# EasyEDA Pro project ProPrj_Arduino_Contest_2025_2025-11-19.epro, schematic Sensor_Module_Rev_1

## Sheets
1 Terminals: Board Name: Sensor_Module_Rev_1; Create Date: 2025-09-15; Page Name: Terminals; Project Name: Arduino_Prj_boards; Schematic Name: Sensor_Module_Rev_1; Update Date: 2025-09-15; Revision: REV0
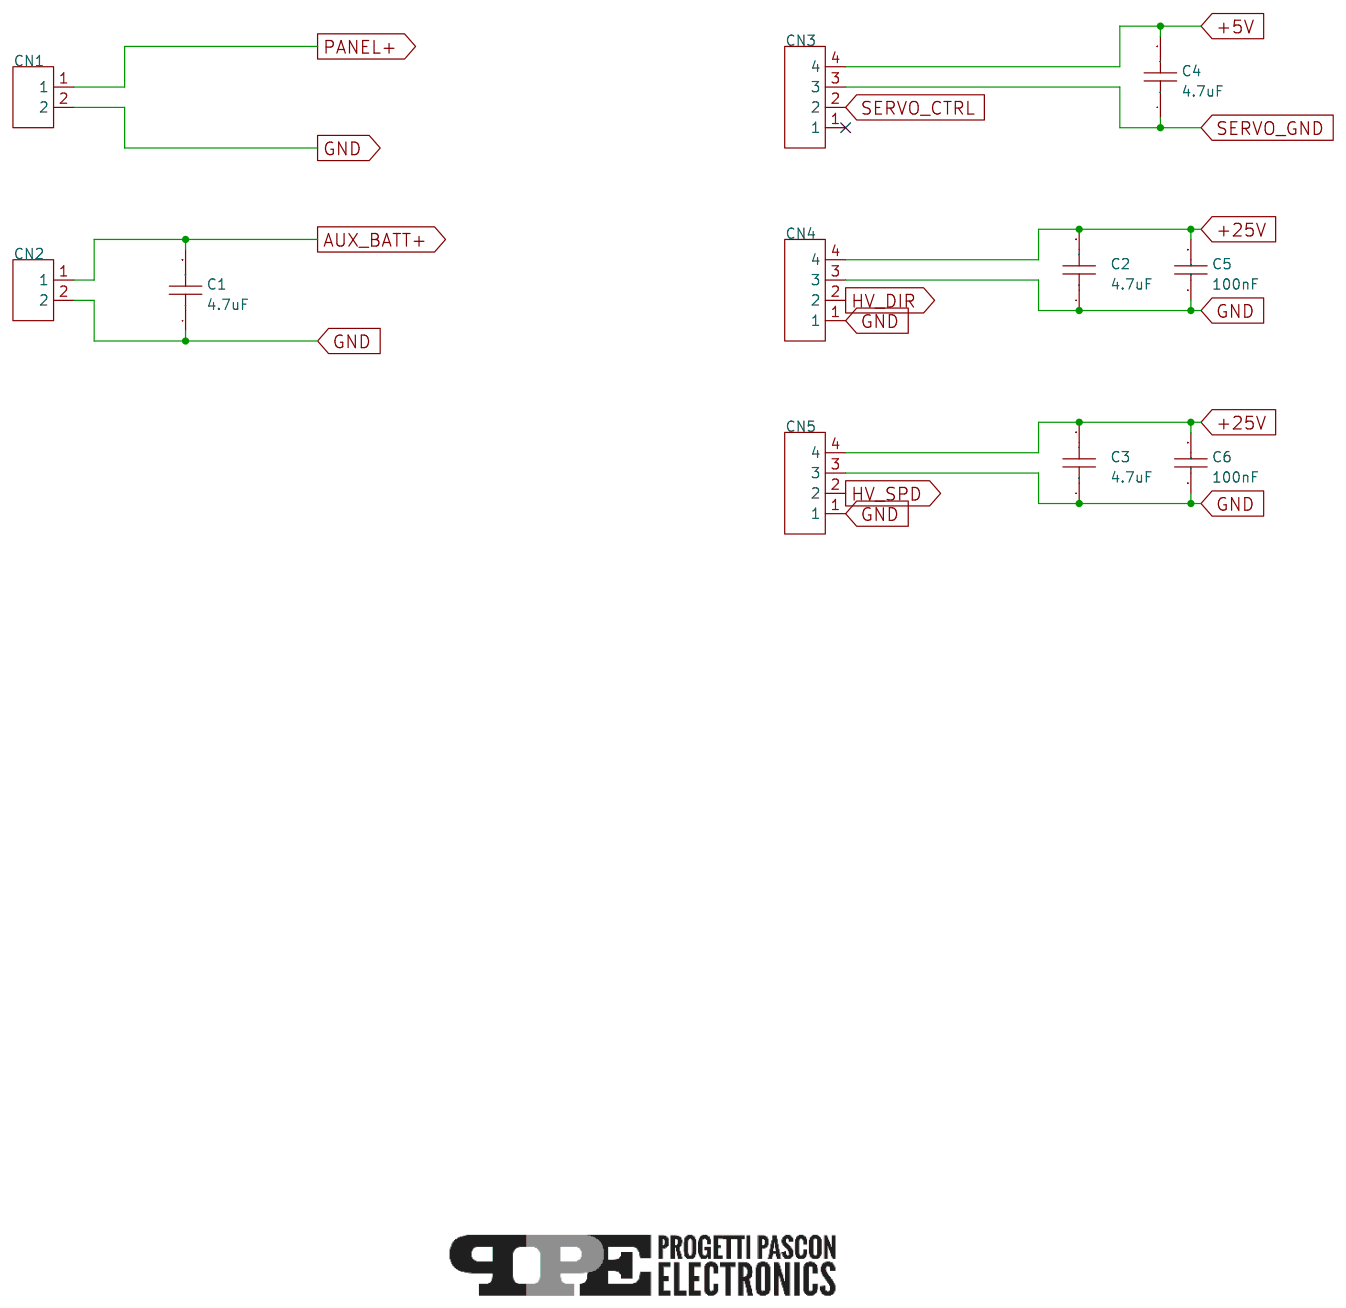
[diagram p7: Terminals]
2 Panel Management: Page Name: Panel Management; Update Date: 2025-09-17
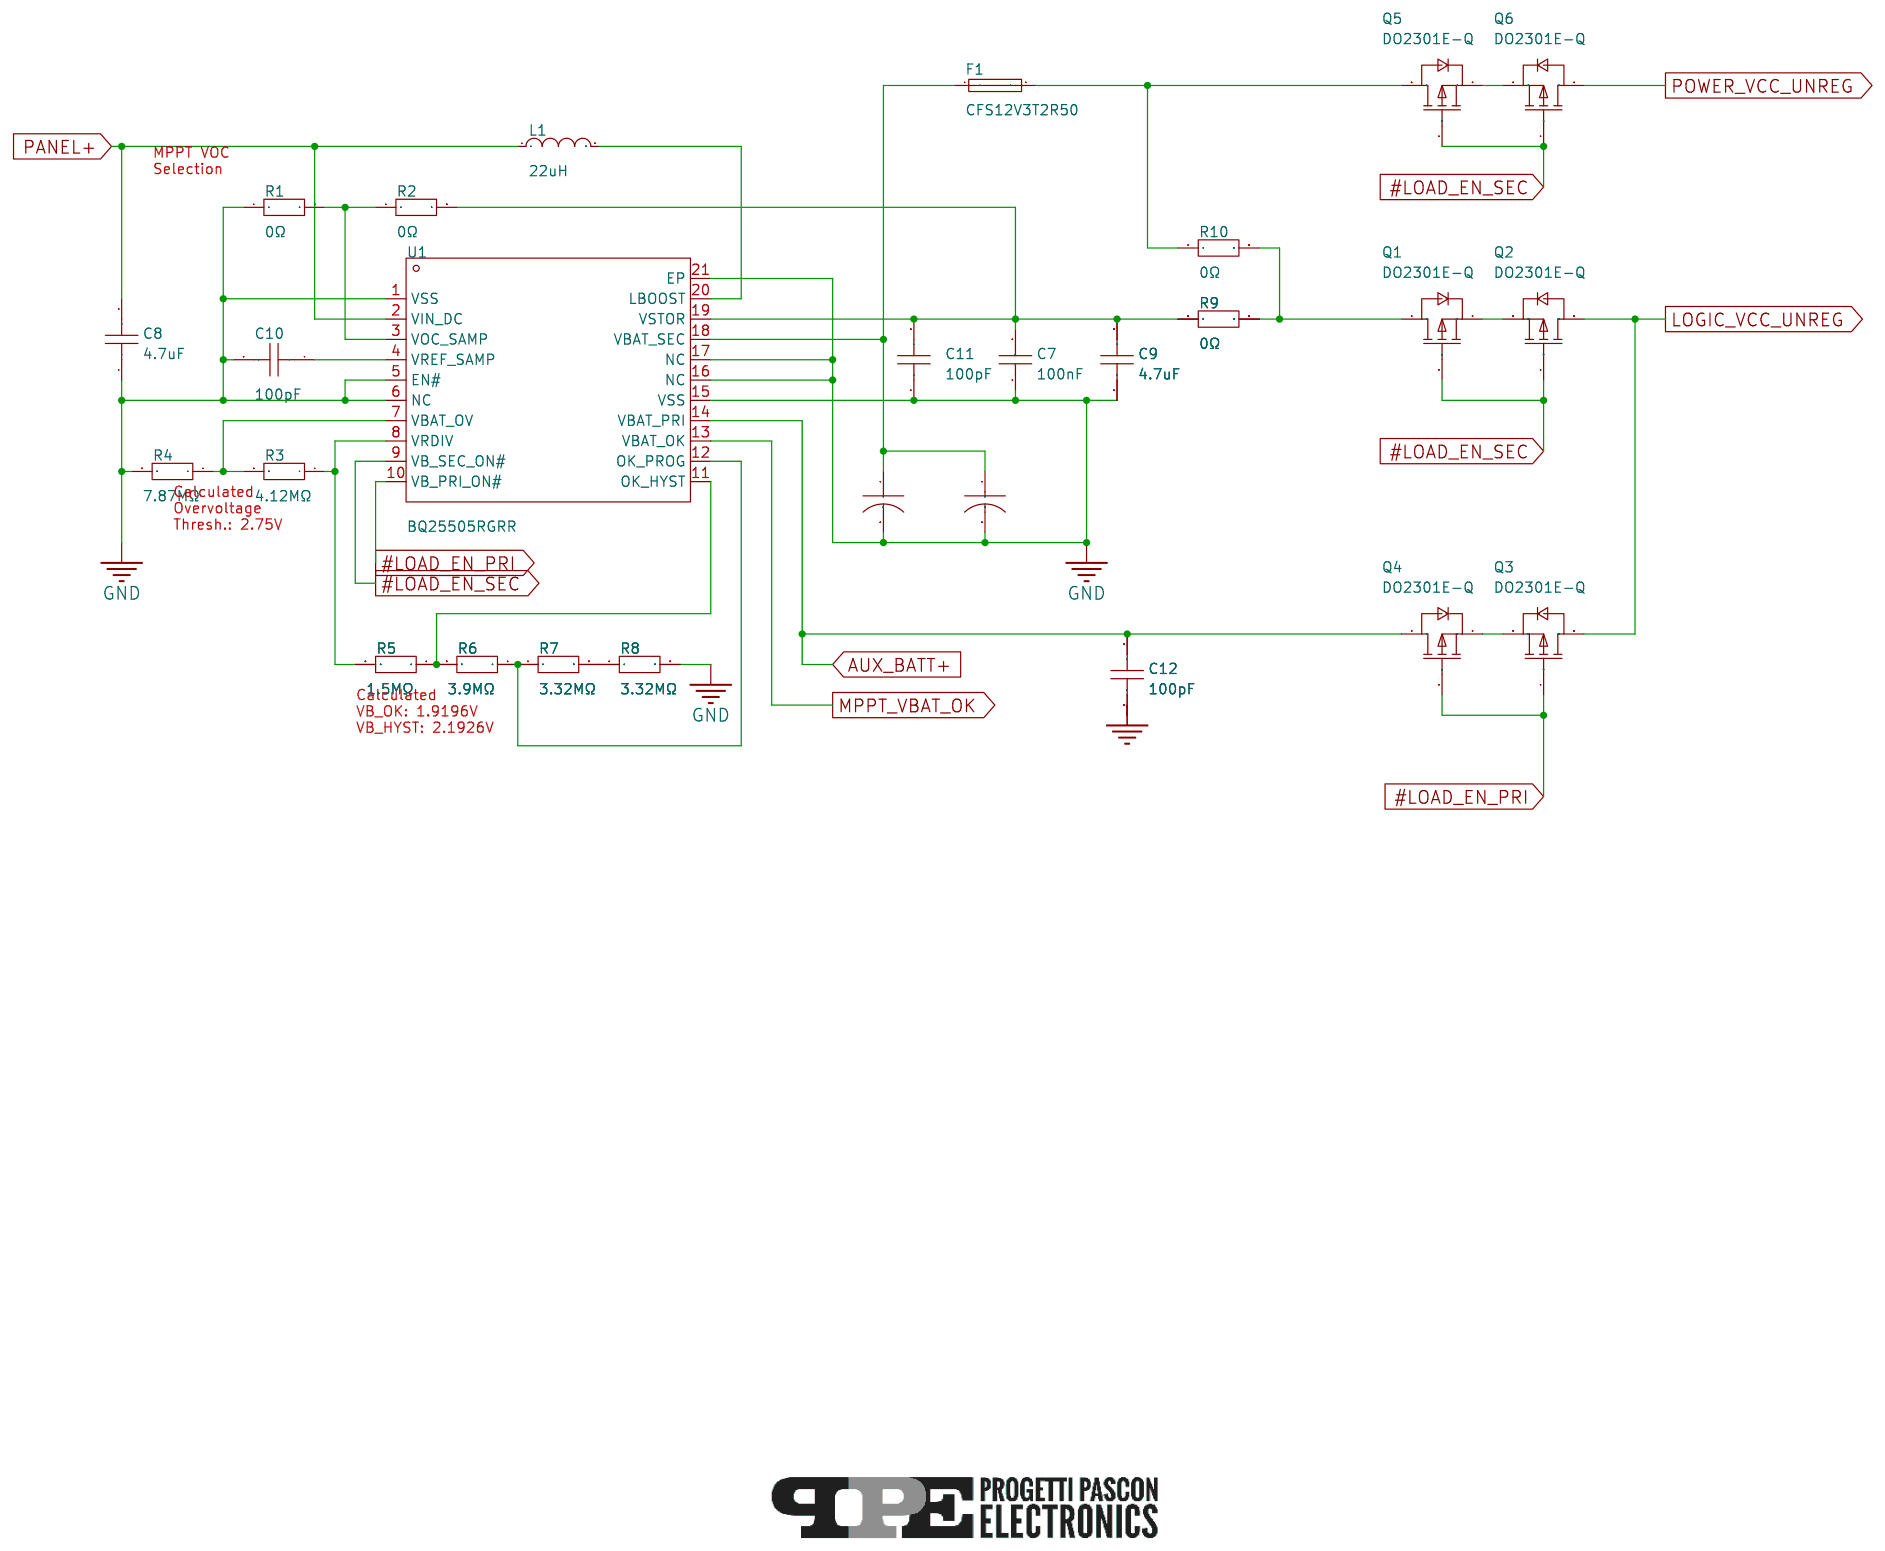
[diagram p8: Panel Management]
3 Geiger Counter: Page Name: Geiger Counter; Update Date: 2025-09-17
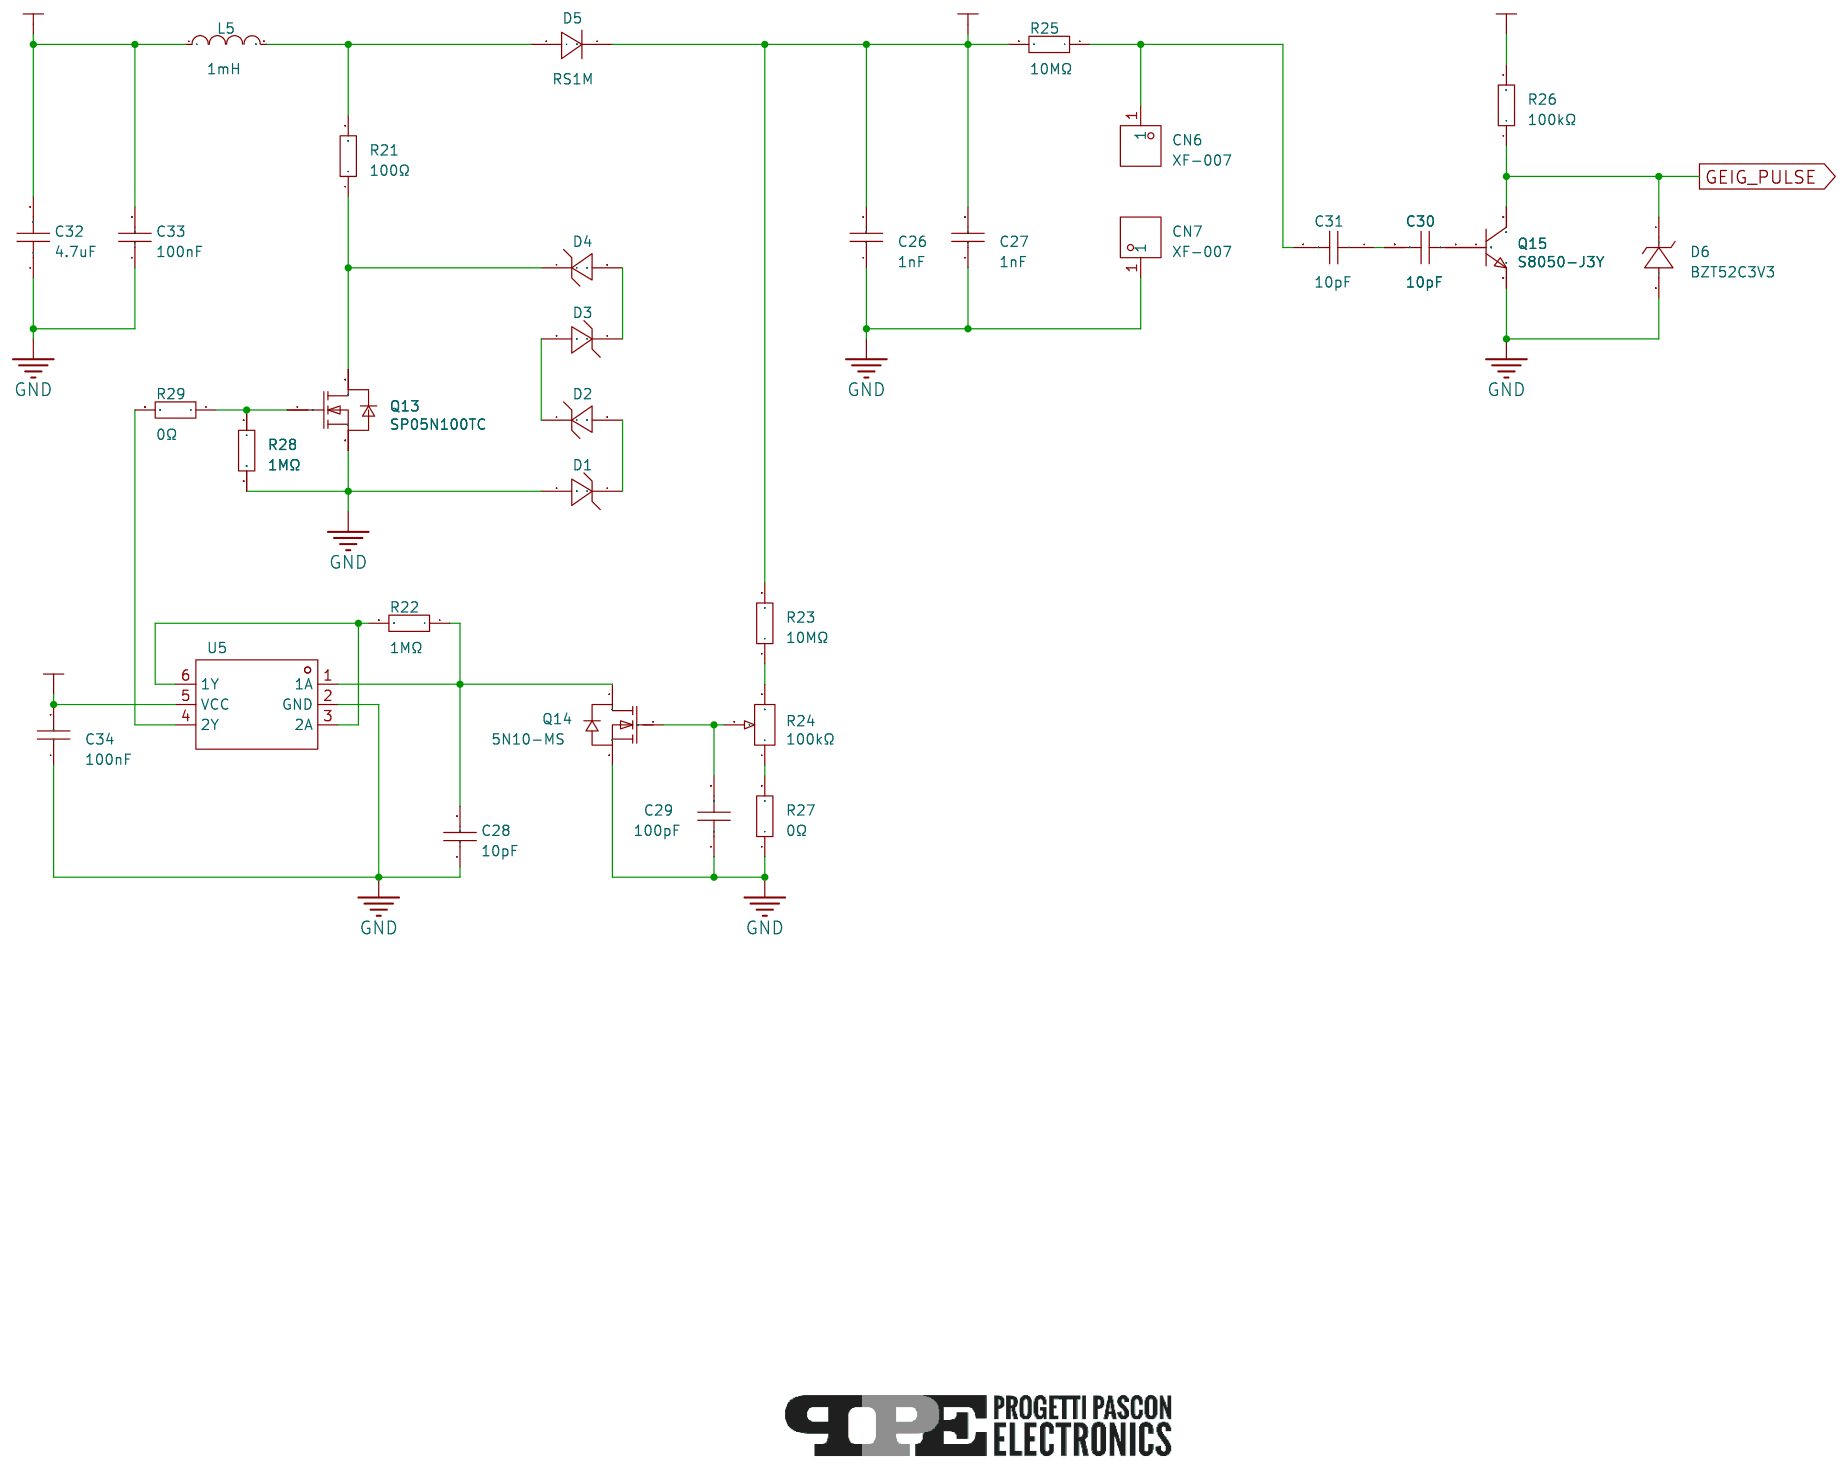
[diagram p9: Geiger Counter]
4 Sensors: Page Name: Sensors; Update Date: 2025-09-17
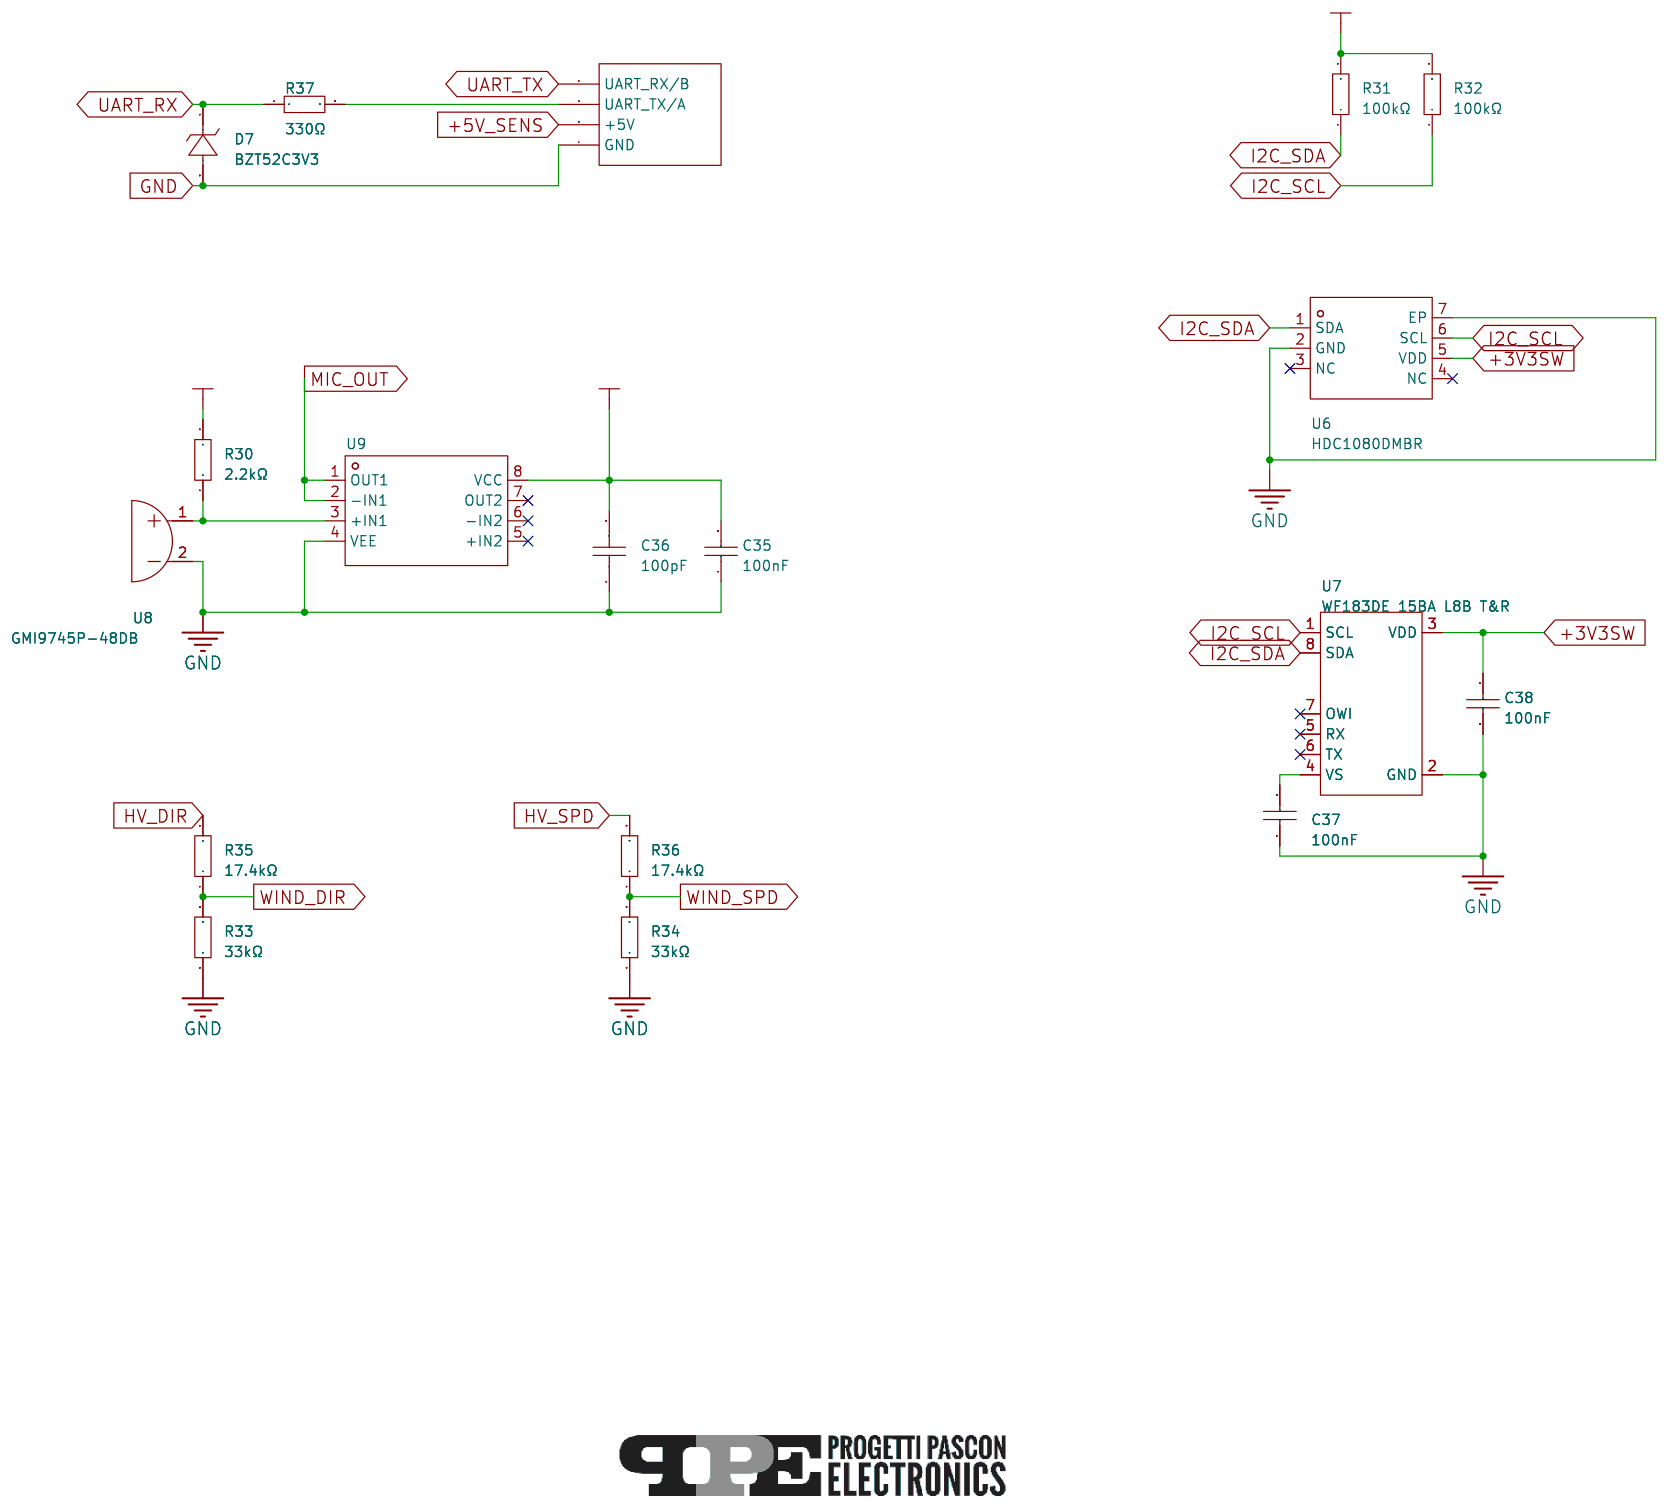
[diagram p10: Sensors]
5 Supply Rails: Page Name: Supply Rails; Update Date: 2025-09-17
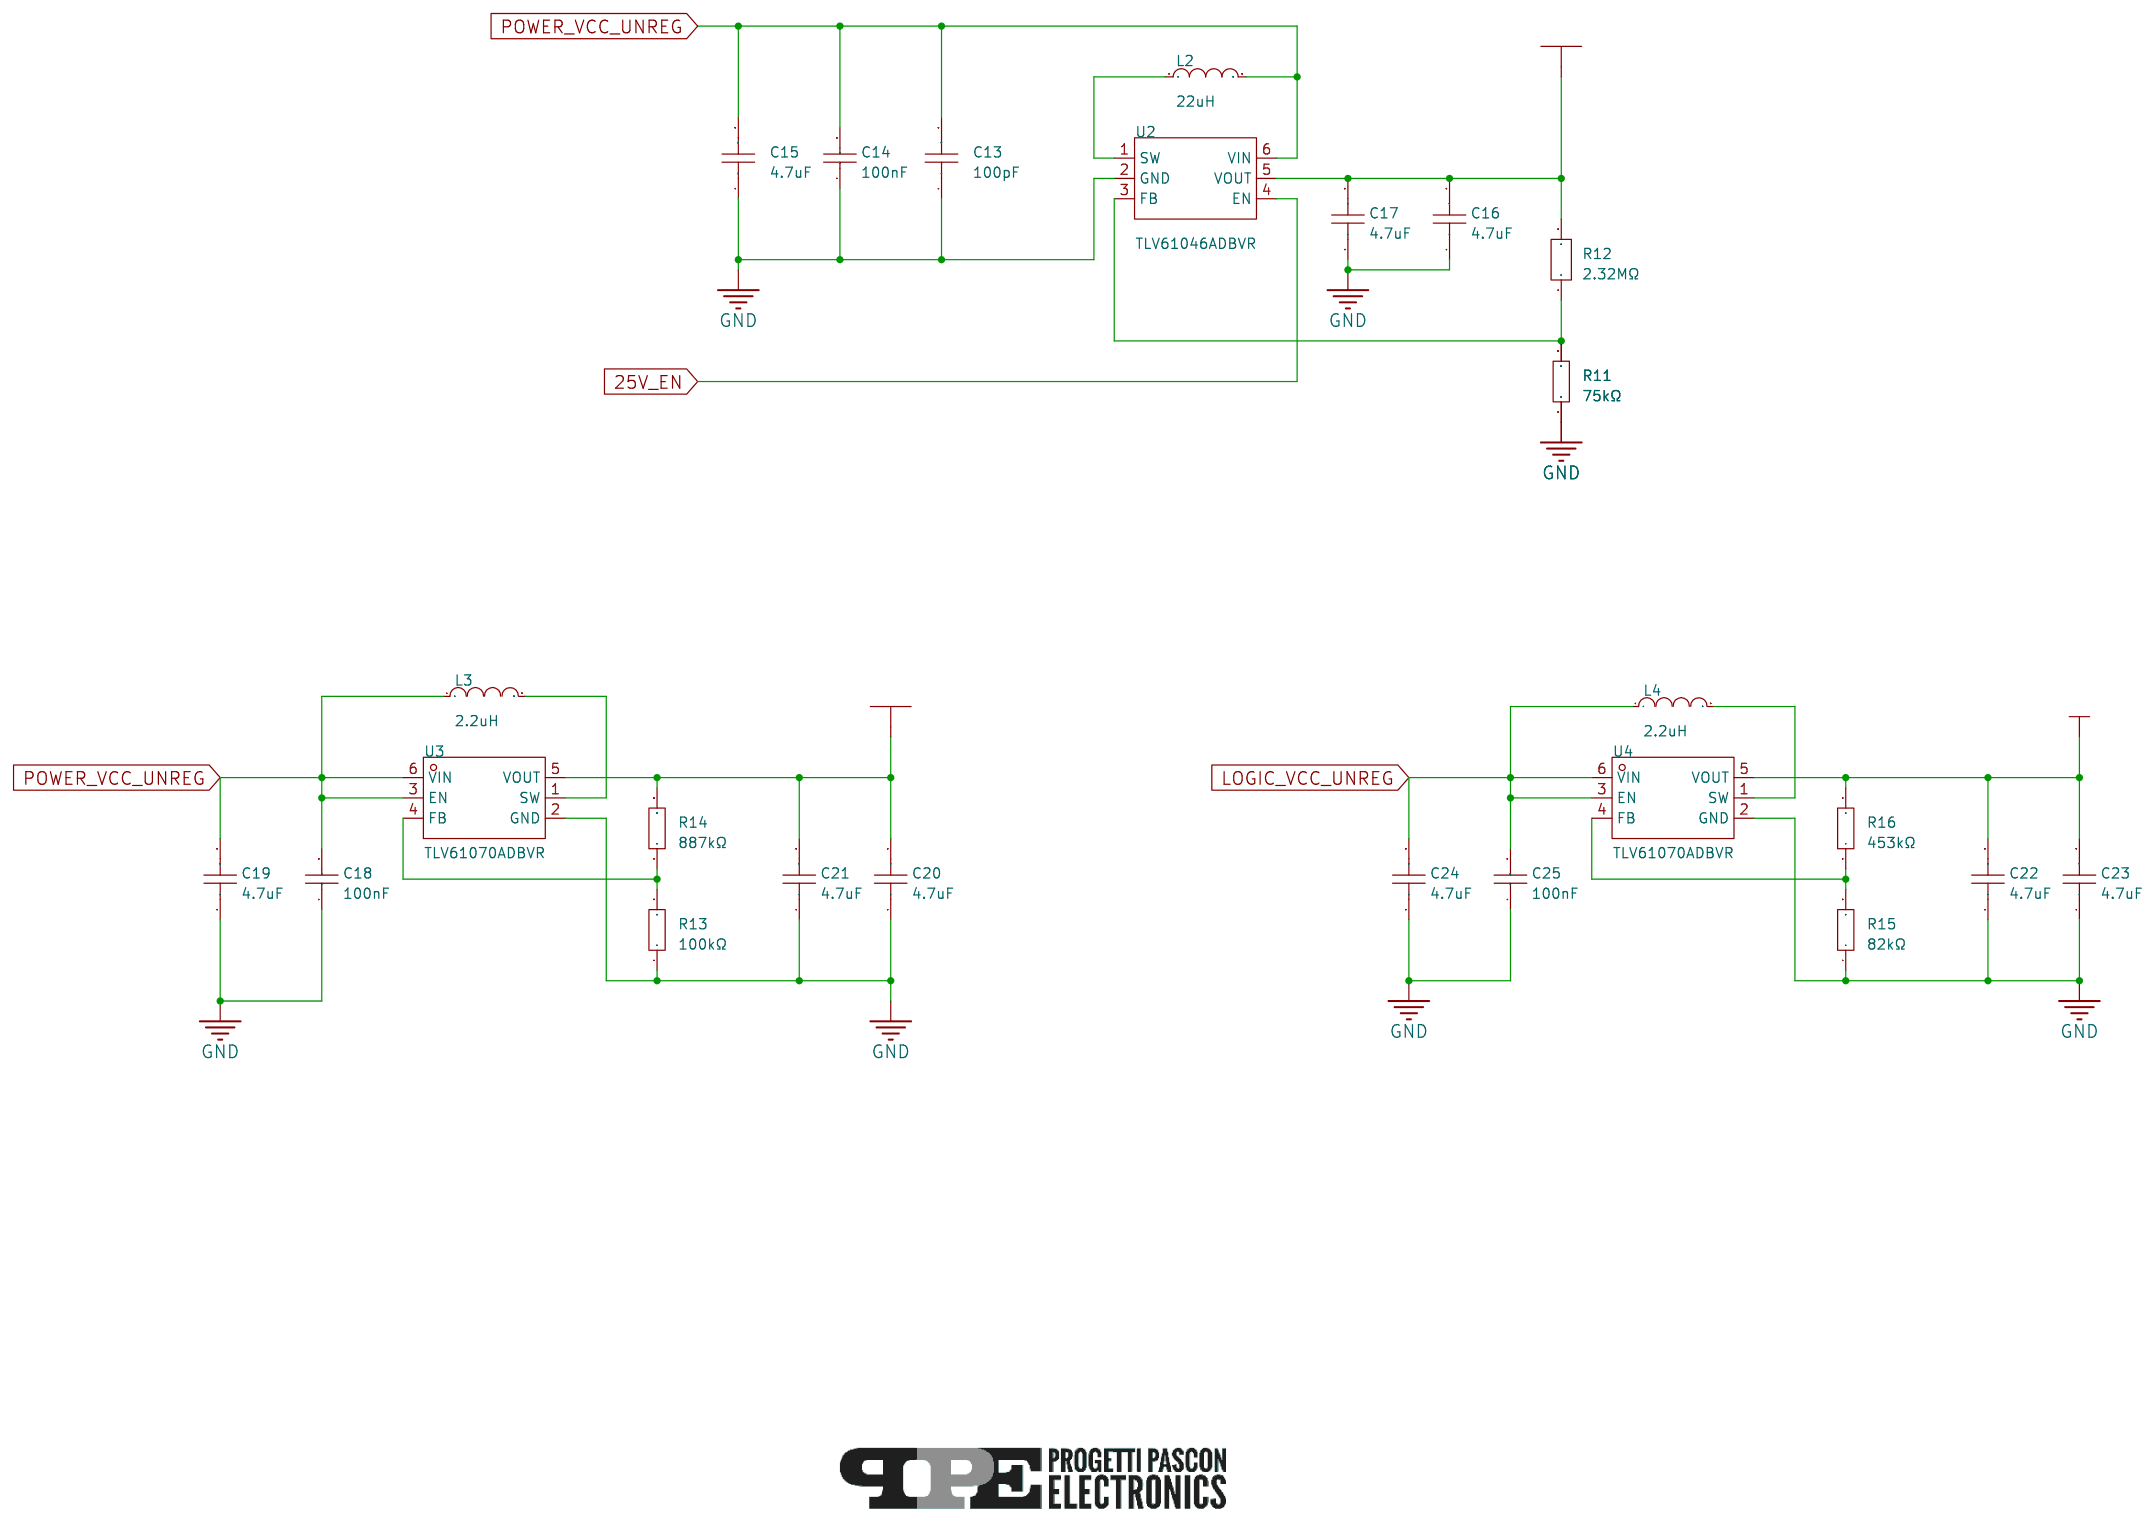
[diagram p11: Supply Rails]
6 MCU & LoRa: Page Name: MCU & LoRa; Update Date: 2025-09-17
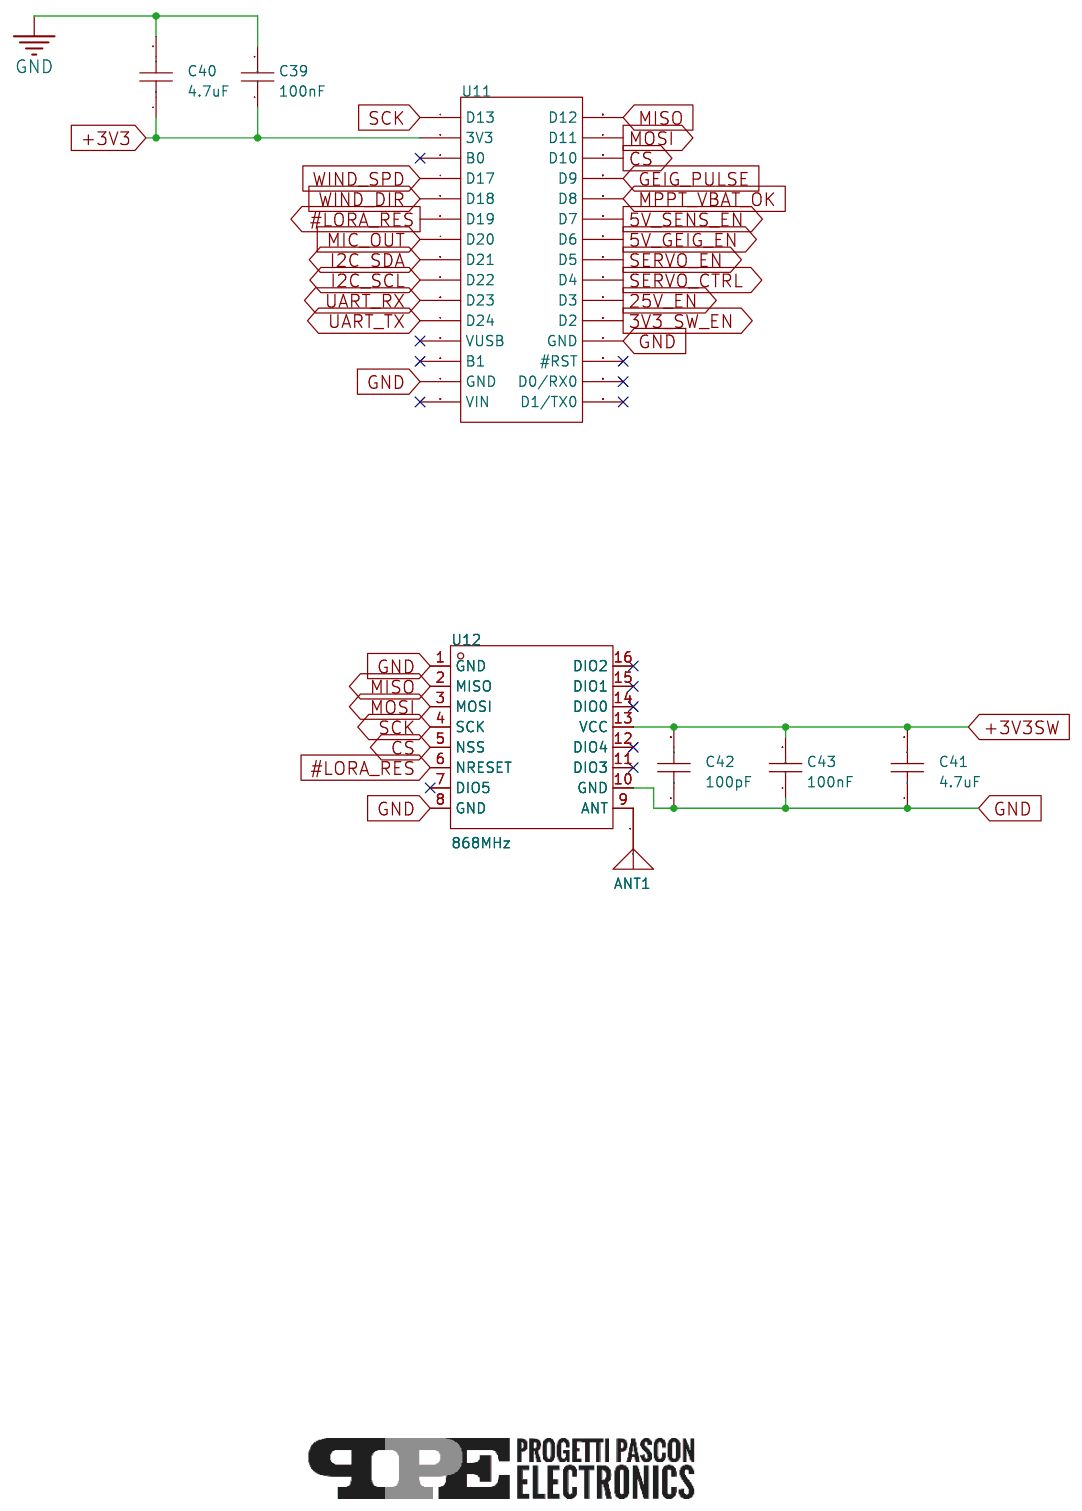
[diagram p12: MCU & LoRa]
7 Rails Switching: Create Date: 2025-09-17; Page Name: Rails Switching; Project Name: Arduino_Contest_2025; Update Date: 2025-11-13
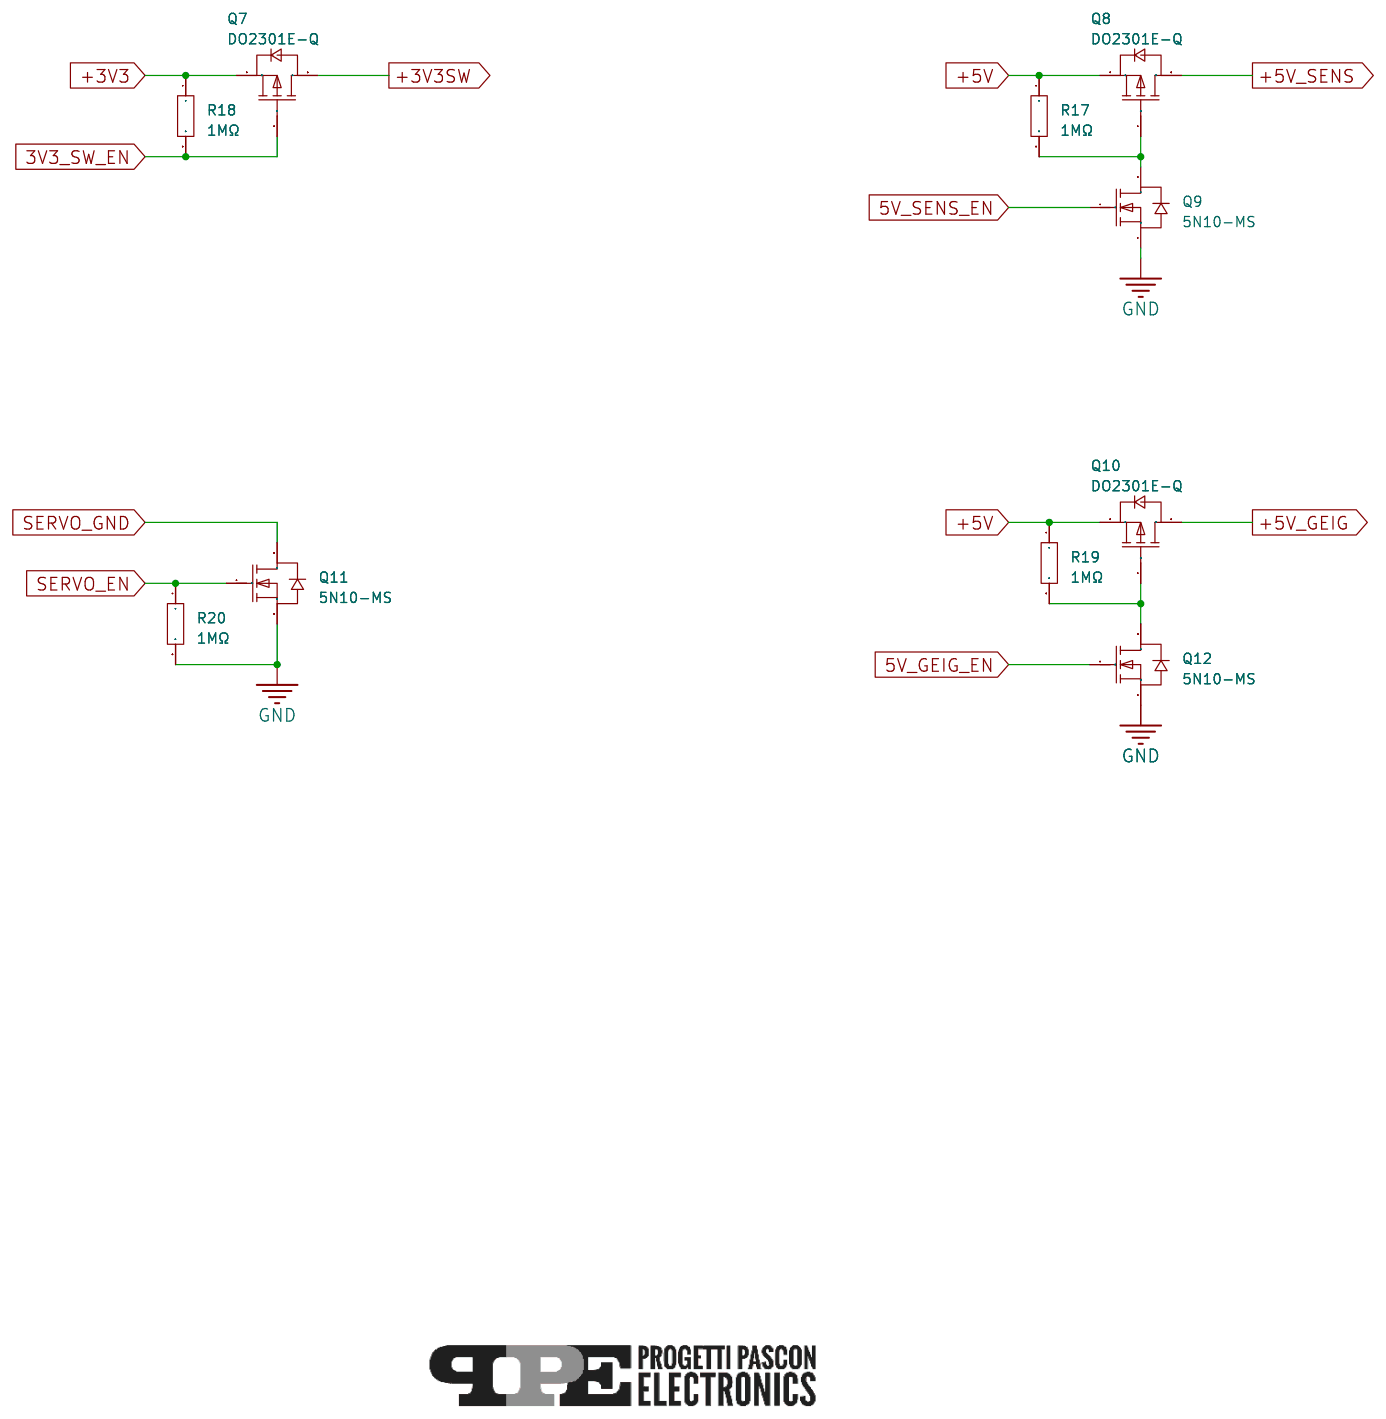
[diagram p13: Rails Switching]

## Parts
sheet Geiger Counter
C26  1nF  [C1206]
C27  1nF  [C1206]
C28  10pF  [C0603]
C29  100pF  [C0603]
C30  10pF  [C1206]
C31  10pF  [C1206]
C32  4.7uF  [C1206]
C33  100nF  [C0603]
C34  100nF  [C0603]
CN6  XF-007  [FUSE-TH_XF-007]
CN7  XF-007  [FUSE-TH_XF-007]
D1  BZD27C200P  [SOD-123_L2.8-W1.8-LS3.7-RD]
D2  BZD27C200P  [SOD-123_L2.8-W1.8-LS3.7-RD]
D3  BZD27C200P  [SOD-123_L2.8-W1.8-LS3.7-RD]
D4  BZD27C200P  [SOD-123_L2.8-W1.8-LS3.7-RD]
D5  RS1M  [SMA_L4.3-W2.6-LS5.2-RD]
D6  BZT52C3V3  [SOD-123_L2.7-W1.6-LS3.7-RD]
L5  1mH  [IND-SMD_L6.0-W6.0]
Q13  SP05N100TC  [SOT-223-3_L6.5-W3.4-P2.30-LS7.0-BR-1]
Q14  5N10-MS  [SOT-23-3_L2.9-W1.3-P1.90-LS2.4-BL-1]
Q15  S8050-J3Y  [SOT-23-3_L2.9-W1.3-P0.95-LS2.4-BR-1]
R21  100Ω  [RES-TH_BD2.2-L6.5-P10.50-D0.6]
R22  1MΩ  [R0603]
R23  10MΩ  [RES-TH_BD2.2-L6.5-P10.50-D0.6]
R24  100kΩ  [RES-ADJ-TH_3P-L9.5-W4.9-P2.50-L_3296W]
R25  10MΩ  [RES-TH_BD2.2-L6.5-P10.50-D0.6]
R26  100kΩ  [R0603]
R27  0Ω  [R0603]
R28  1MΩ  [R0603]
R29  0Ω  [R0603]
U5  SN74LVC2G14DBVR  [SOT-23-6_L2.9-W1.6-P0.95-LS2.8-BR]
sheet MCU & LoRa
ANT1  VG868SNX18-5W2  [ANT-TH_VG868SNX18-5W2]
C39  100nF  [C0603]
C40  4.7uF  [C1206]
C41  4.7uF  [C1206]
C42  100pF  [C0603]
C43  100nF  [C0603]
U11  -  [Arduino_NANO_ESP32]
U12  868MHz  [COMM-SMD_LORA1276-C1-915MHZ]
sheet Panel Management
C7  100nF  [C0603]
C8  4.7uF  [C1206]
C9  4.7uF  [C1206]
C10  100pF  [C0603]
C11  100pF  [C0603]
C12  100pF  [C0603]
F1  CFS12V3T2R50  [F1206]
L1  22uH  [IND-SMD_L4.5-W4.0]
Q1  DO2301E-Q  [SOT-23-3_L3.0-W1.7-P0.95-LS2.9-BR]
Q2  DO2301E-Q  [SOT-23-3_L3.0-W1.7-P0.95-LS2.9-BR]
Q3  DO2301E-Q  [SOT-23-3_L3.0-W1.7-P0.95-LS2.9-BR]
Q4  DO2301E-Q  [SOT-23-3_L3.0-W1.7-P0.95-LS2.9-BR]
Q5  DO2301E-Q  [SOT-23-3_L3.0-W1.7-P0.95-LS2.9-BR]
Q6  DO2301E-Q  [SOT-23-3_L3.0-W1.7-P0.95-LS2.9-BR]
R1  0Ω  [R0603]
R2  0Ω  [R0603]
R3  4.12MΩ  [R0603]
R4  7.87MΩ  [R0603]
R5  1.5MΩ  [R0603]
R6  3.9MΩ  [R0603]
R7  3.32MΩ  [R0603]
R8  3.32MΩ  [R0603]
R9  0Ω  [R0603]
R10  0Ω  [R0603]
SC1  -  [BIGCAP_BUP002R8L107FA]
SC2  -  [BIGCAP_BUP002R8L107FA]
U1  BQ25505RGRR  [VQFN-20_L3.5-W3.5-P0.50-TL-EP]
sheet Rails Switching
Q7  DO2301E-Q  [SOT-23-3_L3.0-W1.7-P0.95-LS2.9-BR]
Q8  DO2301E-Q  [SOT-23-3_L3.0-W1.7-P0.95-LS2.9-BR]
Q9  5N10-MS  [SOT-23-3_L2.9-W1.3-P1.90-LS2.4-BL-1]
Q10  DO2301E-Q  [SOT-23-3_L3.0-W1.7-P0.95-LS2.9-BR]
Q11  5N10-MS  [SOT-23-3_L2.9-W1.3-P1.90-LS2.4-BL-1]
Q12  5N10-MS  [SOT-23-3_L2.9-W1.3-P1.90-LS2.4-BL-1]
R17  1MΩ  [R0603]
R18  1MΩ  [R0603]
R19  1MΩ  [R0603]
R20  1MΩ  [R0603]
sheet Sensors
C35  100nF  [C0603]
C36  100pF  [C0603]
C37  100nF  [C0603]
C38  100nF  [C0603]
D7  BZT52C3V3  [SOD-123_L2.7-W1.6-LS3.7-RD]
R30  2.2kΩ  [R0603]
R31  100kΩ  [R0603]
R32  100kΩ  [R0603]
R33  33kΩ  [R0603]
R34  33kΩ  [R0603]
R35  17.4kΩ  [R0603]
R36  17.4kΩ  [R0603]
R37  330Ω  [R0603]
U6  HDC1080DMBR  [SENSOR-SMD_HDC1080DMBR]
U7  WF183DE 15BA L8B T&R  [LGA-8_L3.8-W3.8-P0.93-BL]
U8  GMI9745P-48DB  [MIC-TH_BD9.7-P2.54-D0.8-L-FD]
U9  BA4558F-E2  [SOP-8_L4.9-W3.9-P1.27-LS6.0-BL]
U10  -  [Saiya_SYP16]
sheet Supply Rails
C13  100pF  [C0603]
C14  100nF  [C0603]
C15  4.7uF  [C1206]
C16  4.7uF  [C1206]
C17  4.7uF  [C1206]
C18  100nF  [C0603]
C19  4.7uF  [C1206]
C20  4.7uF  [C1206]
C21  4.7uF  [C1206]
C22  4.7uF  [C1206]
C23  4.7uF  [C1206]
C24  4.7uF  [C1206]
C25  100nF  [C0603]
L2  22uH  [IND-SMD_L4.5-W4.0]
L3  2.2uH  [L1008]
L4  2.2uH  [L1008]
R11  75kΩ  [R0603]
R12  2.32MΩ  [R0603]
R13  100kΩ  [R0603]
R14  887kΩ  [R0603]
R15  82kΩ  [R0603]
R16  453kΩ  [R0603]
U2  TLV61046ADBVR  [SOT-23-6_L2.9-W1.6-P0.95-LS2.8-BL]
U3  TLV61070ADBVR  [SOT-23-6_L2.9-W1.6-P0.95-LS2.8-BR]
U4  TLV61070ADBVR  [SOT-23-6_L2.9-W1.6-P0.95-LS2.8-BR]
sheet Terminals
C1  4.7uF  [C1206]
C2  4.7uF  [C1206]
C3  4.7uF  [C1206]
C4  4.7uF  [C1206]
C5  100nF  [C0603]
C6  100nF  [C0603]
CN1  DB125-2.54-2P-GN-S  [CONN-TH_DB125-2.54-2P-GN]
CN2  DB125-2.54-2P-GN-S  [CONN-TH_DB125-2.54-2P-GN]
CN3  DB125-2.54-4P-GN-S  [CONN-TH_DB125-2.54-4P-GN]
CN4  DB125-2.54-4P-GN-S  [CONN-TH_DB125-2.54-4P-GN]
CN5  DB125-2.54-4P-GN-S  [CONN-TH_DB125-2.54-4P-GN]

## Library data of the parts
C26 C27 = CC1206KKX7RDBB102: Capacitance: Tolerance:±10% Tolerance:±10% Voltage Rated: Temperature Coefficient:; LCSC Part Name: 1nF ±10% 2kV; Supplier Part: C23631; Manufacturer: YAGEO(国巨); Supplier Footprint: 1206; JLCPCB Part Class: Extended Part; Datasheet: https://atta.szlcsc.com/upload/public/pdf/source/20180910/C282080_BCE296114B59C3710FB69343383A5C6E.pdf; Supplier: LCSC; Tolerance: ±10%
C28 = CC0603JRNPO9BN100: Capacitance: Tolerance:±5% Tolerance:±5% Voltage Rated: Temperature Coefficient:; LCSC Part Name: 10pF ±5% 50V; Supplier Part: C106245; Manufacturer: YAGEO(国巨); Supplier Footprint: 0603; JLCPCB Part Class: Extended Part; Datasheet: https://atta.szlcsc.com/upload/public/pdf/source/20170505/1493957838062.pdf; Supplier: LCSC; Tolerance: ±5%
C10-C13 C29 C36 C42 = CL10C101JB8NNNC: Capacitance: Tolerance:±5% Tolerance:±5% Voltage Rated: Temperature Coefficient:; LCSC Part Name: 100pF ±5% 50V; Supplier Part: C14858; Manufacturer: SAMSUNG(三星); Supplier Footprint: 0603; JLCPCB Part Class: Basic Part; Datasheet: https://atta.szlcsc.com/upload/public/pdf/source/20160218/1457707763339.pdf; Supplier: LCSC; Tolerance: ±5%
C30 C31 = TCC1206COG100J102DT: Capacitance:10pF Tolerance:±5% Tolerance:±5% Voltage Rating:1000V Temperature Coefficient:C0G; LCSC Part Name: 10pF ±5% 1kV; Supplier Part: C377014; Manufacturer: CCTC(三环); Supplier Footprint: 1206; JLCPCB Part Class: Extended Part; Datasheet: https://atta.szlcsc.com/upload/public/pdf/source/20191203/C466239_F62A586702D44EEA1C39B32FC8662B21.pdf; Supplier: LCSC; Tolerance: ±5%; Voltage Rating: 1000V; Temperature Coefficient: C0G
C1-C4 C8 C9 C15-C17 C19-C24 C32 C40 C41 = CL31B475KBHNNNE: Capacitance: Tolerance:±10% Tolerance:±10% Voltage Rated: Temperature Coefficient:; LCSC Part Name: 4.7uF ±10% 50V; Supplier Part: C51205; Manufacturer: SAMSUNG(三星); Supplier Footprint: 1206; JLCPCB Part Class: Extended Part; Datasheet: https://atta.szlcsc.com/upload/public/pdf/source/20160218/1457707763339.pdf; Supplier: LCSC; Tolerance: ±10%
C5-C7 C14 C18 C25 C33-C35 C37-C39 C43 = CC0603KRX7R9BB104: Capacitance:100nF Tolerance:±10% Tolerance:±10% Voltage Rating:50V Temperature Coefficient:X7R; LCSC Part Name: 100nF ±10% 50V; Supplier Part: C14663; Manufacturer: YAGEO(国巨); Supplier Footprint: 0603; JLCPCB Part Class: Basic Part; Datasheet: https://atta.szlcsc.com/upload/public/pdf/source/20250214/096C4C206003071F5D32E5F0D8E7F8DF.pdf; Supplier: LCSC; Tolerance: ±10%; Voltage Rating: 50V; Temperature Coefficient: X7R
CN6 CN7 = XF-007: Fuseholder Type:- Voltage Rating:250V Current Rating:10A Fuse Type:-; LCSC Part Name: 保险丝夹 6.35x32mm; Supplier Part: C717028; Manufacturer: XFCN(兴飞); Supplier Footprint: 插件,P=7.1mm; JLCPCB Part Class: Extended Part; Datasheet: https://atta.szlcsc.com/upload/public/pdf/source/20200812/C717028_2A06938E093707E4A62A6BC204F0EB9A.pdf; Supplier: LCSC; Voltage Rating: 250V; Current Rating: 10A
D1-D4 = BZD27C200P: Diode Configuration:Single Zener Voltage (Nom):- Reverse Leakage Current (Ir):1uA@150V Zener Voltage (Range):188V~212V Zener Voltage (Range):188V~212V Power Dissipation:800mW Zener Impedance (Zzt):500Ω Tolerance:- Tolerance:-; Supplier Part: C362296; Manufacturer: LGE(鲁光); Supplier Footprint: SOD-123FL; JLCPCB Part Class: Extended Part; Datasheet: https://atta.szlcsc.com/upload/public/pdf/source/20190215/C362296_CBDC61B4146C3E14B9378DF1F8E05536.pdf; Supplier: LCSC; Diode Configuration: Single; Reverse Leakage Current (Ir): 1uA@150V; Zener Voltage (Range): 188V~212V; Power Dissipation: 800mW; Zener Impedance (Zzt): 500Ω
D5 = RS1M_C513461: Diode Configuration: Forward Voltage (Vf@If):1.3V@1A Reverse Voltage (Vr): Rectified Current: Reverse Leakage Current (Ir):5uA@1000V Reverse Recovery Time (trr): Operating Temperature:-55℃~+150℃@(Tj) Operating Temperature:-55℃~+150℃@(Tj); Supplier Part: C513461; Manufacturer: Slkor(萨科微); Supplier Footprint: SMA(DO-214AC); JLCPCB Part Class: Extended Part; Datasheet: https://atta.szlcsc.com/upload/public/pdf/source/20200414/C513461_7611D3E05F8D7FE6DF6717314864C366.pdf; Supplier: LCSC; Forward Voltage (Vf@If): 1.3V@1A; Reverse Leakage Current (Ir): 5uA@1000V; Operating Temperature: -55℃~+150℃@(Tj)
D6 D7 = BZT52C3V3_C173413: Diode Configuration:Independent Type Zener Voltage(Nom):3.3V Reverse Leakage Current (Ir):20uA@1V Zener Voltage(Range):3.1V~3.5V Zener Voltage(Range):3.1V~3.5V Pd - Power Dissipation(Pd):500mW Impedance(Zzt):130Ω; Supplier Part: C173413; Manufacturer: MDD(辰达半导体); Supplier Footprint: SOD-123; JLCPCB Part Class: Extended Part; Datasheet: https://atta.szlcsc.com/upload/public/pdf/source/20241121/F5439B697EC7888E343325F3F630C595.pdf; Supplier: LCSC; Diode Configuration: Independent Type; Zener Voltage(Nom): 3.3V; Reverse Leakage Current (Ir): 20uA@1V; Zener Voltage(Range): 3.1V~3.5V; Pd - Power Dissipation(Pd): 500mW; Impedance(Zzt): 130Ω
L5 = YNR6045-102M: Inductance: Tolerance:±20% Tolerance:±20% Rated Current: DC Resistance (DCR):; LCSC Part Name: 1mH ±20%; Supplier Part: C497845; Manufacturer: YJYCOIN(益嘉源); Supplier Footprint: SMD,6x6mm; JLCPCB Part Class: Extended Part; Datasheet: https://atta.szlcsc.com/upload/public/pdf/source/20200317/C497838_ADAADDA66AFC043F2D8B9A62FB946728.pdf; Supplier: LCSC; Tolerance: ±20%
Q13 = SP05N100TC: Number:- Drain to Source Voltage:1kV Current - Continuous Drain(Id):500mA RDS(on):40Ω@10V,0.3A Pd - Power Dissipation:3.6W Gate Threshold Voltage (Vgs(th)@Id):2V Gate Charge(Qg):- Input Capacitance(Ciss):472pF@25V Reverse Transfer Capacitance (Crss@Vds):1; LCSC Part Name: VDMOS; Supplier Part: C42372396; Manufacturer: Siliup(矽普); Supplier Footprint: SOT-223; JLCPCB Part Class: Extended Part; Datasheet: https://atta.szlcsc.com/upload/public/pdf/source/20250218/C69D690569C5C1EF9B9D91F34114056E.pdf; Supplier: LCSC; Drain to Source Voltage: 1kV; Current - Continuous Drain(Id): 500mA; RDS(on): 40Ω@10V,0.3A; Pd - Power Dissipation: 3.6W; Gate Threshold Voltage (Vgs(th)@Id): 2V; Input Capacitance(Ciss): 472pF@25V; Reverse Transfer Capacitance (Crss@Vds): 1.2pF@25V; Operating Temperature: -55℃~+150℃
Q9 Q11 Q12 Q14 = 5N10-MS: Type:1 N-channel Drain Source Voltage (Vdss): Continuous Drain Current (Id): Drain Source On Resistance (RDS(on)@Vgs,Id):105mΩ@10V,3A Power Dissipation (Pd): Gate Threshold Voltage (Vgs(th)@Id):1V@250uA Total Gate Charge (Qg@Vgs):4.3nC@10V Input Capacitan; LCSC Part Name: N沟道,电流:5A,耐压:100V; Supplier Part: C5140036; Manufacturer: MSKSEMI(美森科); Supplier Footprint: SOT-23; JLCPCB Part Class: Extended Part; Datasheet: https://atta.szlcsc.com/upload/public/pdf/source/20221027/E8FFDDC8DC95174CD6FB8E74CDC88308.pdf; Supplier: LCSC; Type: 1 N-channel; Drain Source On Resistance (RDS(on)@Vgs,Id): 105mΩ@10V,3A; Gate Threshold Voltage (Vgs(th)@Id): 1V@250uA; Total Gate Charge (Qg@Vgs): 4.3nC@10V; Input Capacitance (Ciss@Vds): 196pF@50V; Reverse Transfer Capacitance (Crss@Vds): 21.4pF@50V; Operating Temperature: -55℃~+150℃
Q15 = S8050-J3Y_C18221467: type:NPN Current - Collector(Ic):300mA Collector - Emitter Voltage VCEO:25V Pd - Power Dissipation:300mW DC Current Gain:350@50mA,1V DC Current Gain:350@50mA,1V Transition frequency(fT):150MHz Current - Collector Cutoff:100nA Vce Saturation(VCE(sat)):600m; LCSC Part Name: hFE:200-300 S8050-J3Y; Supplier Part: C18221467; Manufacturer: JSMSEMI(杰盛微); Supplier Footprint: SOT-23; JLCPCB Part Class: Extended Part; Datasheet: https://atta.szlcsc.com/upload/public/pdf/source/20231012/B1036D3E74EDF66F384E85A64ABC053C.pdf; Supplier: LCSC; type: NPN; Current - Collector(Ic): 300mA; Collector - Emitter Voltage VCEO: 25V; Pd - Power Dissipation: 300mW; DC Current Gain: 350@50mA,1V; Transition frequency(fT): 150MHz; Current - Collector Cutoff: 100nA; Vce Saturation(VCE(sat)): 600mV@500mA,50mA; Emitter-Base Voltage(Vebo): 5V
R21 = MFR0W4F1000A50: Type:Metal Film Resistors Resistance: Tolerance:±1% Tolerance:±1% Voltage-Supply(Max):250V Power(Watts):250mW Temperature Coefficient:±50ppm/℃ Temperature Coefficient:±50ppm/℃; LCSC Part Name: 100Ω ±1% 250mW 金属膜电阻 铜脚，圆柱状直插; Supplier Part: C57438; Manufacturer: UNI-ROYAL(厚声); Supplier Footprint: 插件,D2.2xL6.5mm; JLCPCB Part Class: Extended Part; Datasheet: https://atta.szlcsc.com/upload/public/pdf/source/20191012/C436293_8820AA14BC71FA35E551C06C441482A0.pdf; Supplier: LCSC; Type: Metal Film Resistors; Tolerance: ±1%; Voltage-Supply(Max): 250V; Power(Watts): 250mW; Temperature Coefficient: ±50ppm/℃
R17-R20 R22 R28 = 0603WAF1004T5E: Type:Thick Film Resistors Resistance:1MΩ Tolerance:±1% Tolerance:±1% Power(Watts): Overload Voltage (Max): Temperature Coefficient:±100ppm/℃ Temperature Coefficient:±100ppm/℃ Operating Temperature Range:-55℃~+155℃ Operating Temperature Range:-55℃~+155℃; LCSC Part Name: 1MΩ ±1% 100mW 厚膜电阻; Supplier Part: C22935; Manufacturer: UNI-ROYAL(厚声); Supplier Footprint: 0603; JLCPCB Part Class: Basic Part; Datasheet: https://atta.szlcsc.com/upload/public/pdf/source/20200306/C422600_1E6D84923E4A46A82E41ADD87F860B5C.pdf; Supplier: LCSC; Type: Thick Film Resistors; Tolerance: ±1%; Temperature Coefficient: ±100ppm/℃; Operating Temperature Range: -55℃~+155℃
R23 R25 = MF1/4W-10MΩ±1% T: Type:Metal Film Resistors Resistance: Tolerance:±1% Tolerance:±1% Voltage-Supply(Max):250V Power(Watts):250mW Temperature Coefficient:±100ppm/℃ Temperature Coefficient:±100ppm/℃ Operating Temperature:-55℃~+155℃ Operating Temperature:-55℃~+155℃; LCSC Part Name: 10MΩ ±1% 250mW 金属膜电阻; Supplier Part: C136529; Manufacturer: CCO(千志电子); Supplier Footprint: 插件,D2.3xL6.5mm; JLCPCB Part Class: Extended Part; Datasheet: https://atta.szlcsc.com/upload/public/pdf/source/20190910/C427326_62A6D058BC0FF74963A2F22379CA06CE.pdf; Supplier: LCSC; Type: Metal Film Resistors; Tolerance: ±1%; Voltage-Supply(Max): 250V; Power(Watts): 250mW; Temperature Coefficient: ±100ppm/℃; Operating Temperature: -55℃~+155℃
R24 = 3296W-1-104_C118963: Resistance: Tolerance:±10% Tolerance:±10%; LCSC Part Name: 100kΩ ±10%; Supplier Part: C118963; Manufacturer: BOCHEN(博晨); Manufacturer Part: 3296W-1-104; Supplier Footprint: 插件; JLCPCB Part Class: Extended Part; Datasheet: https://atta.szlcsc.com/upload/public/pdf/source/20171114/C118963_15106326662041117450.pdf; Supplier: LCSC; Tolerance: ±10%
R13 R26 R31 R32 = 0603WAF1003T5E: Type:Thick Film Resistors Resistance:100kΩ Tolerance:±1% Tolerance:±1% Power(Watts): Overload Voltage (Max): Temperature Coefficient:±100ppm/℃ Temperature Coefficient:±100ppm/℃ Operating Temperature Range:-55℃~+155℃ Operating Temperature Range:-55℃~+155℃; LCSC Part Name: 100kΩ ±1% 100mW 厚膜电阻; Supplier Part: C25803; Manufacturer: UNI-ROYAL(厚声); Supplier Footprint: 0603; JLCPCB Part Class: Basic Part; Datasheet: https://atta.szlcsc.com/upload/public/pdf/source/20200306/C422600_1E6D84923E4A46A82E41ADD87F860B5C.pdf; Supplier: LCSC; Type: Thick Film Resistors; Tolerance: ±1%; Temperature Coefficient: ±100ppm/℃; Operating Temperature Range: -55℃~+155℃
R1 R2 R9 R10 R27 R29 = 0603WAF0000T5E: Type:Thick Film Resistors Resistance: Tolerance:±1% Tolerance:±1% Power(Watts): Overload Voltage (Max): Operating Temperature Range:-55℃~+155℃ Operating Temperature Range:-55℃~+155℃; LCSC Part Name: 0Ω ±1% 100mW 厚膜电阻; Supplier Part: C21189; Manufacturer: UNI-ROYAL(厚声); Supplier Footprint: 0603; JLCPCB Part Class: Basic Part; Datasheet: https://atta.szlcsc.com/upload/public/pdf/source/20200306/C422600_1E6D84923E4A46A82E41ADD87F860B5C.pdf; Supplier: LCSC; Type: Thick Film Resistors; Tolerance: ±1%; Operating Temperature Range: -55℃~+155℃
U5 = SN74LVC2G14DBVR: Input Type:Schmitt Trigger Voltage - Supply:1.65V~5.5V Voltage - Supply:1.65V~5.5V Current - Supply:10uA Number of Circuits:2 Number of Inputs:2 Current - Output Low(IOL):32mA Current - Output High(IOH):32mA Input Logic Level - High:1.4V~3.7V Input Logic; LCSC Part Name: 双路施密特触发反相器; Supplier Part: C12401; Manufacturer: TI(德州仪器); Supplier Footprint: SOT-23-6; JLCPCB Part Class: Extended Part; Datasheet: https://www.ti.com/cn/lit/gpn/sn74lvc2g14; Supplier: LCSC; Input Type: Schmitt Trigger; Voltage - Supply: 1.65V~5.5V; Current - Supply: 10uA; Number of Circuits: 2; Number of Inputs: 2; Current - Output Low(IOL): 32mA; Current - Output High(IOH): 32mA; Input Logic Level - High: 1.4V~3.7V; Input Logic Level -Low: 300mV~1.4V; Max Propagation Delay: 4.7ns@5V,50pF; Series: 74LVCSeries; Operating Temperature: -40℃~+125℃
ANT1 = VG868SNX18-5W2: LCSC Part Name: 868MHZ天线高增益弹簧; Supplier Part: C718843; Manufacturer: Vollgo(沃进); JLCPCB Part Class: Extended Part; Datasheet: https://atta.szlcsc.com/upload/public/pdf/source/20200806/C718843_9FD966E7A87F359AA794720160AB31F3.pdf; Supplier: LCSC
U11 = Arduino_NANO_ESP32
U12 = lora1276-C1-868MHz: Frequency:868MHz Output Power:20dBm Output Power:20dBm Interface Type:SPI Modulation System:LoRa；GFSK；FSK Voltage - Supply:1.8V~3.7V Voltage - Supply:1.8V~3.7V Receive  Current:10.8mA Send  Current:120mA Sensitivity:-139dBm Sensitivity:-139dBm; LCSC Part Name: 868MHz无线模块; Supplier Part: C3001532; Manufacturer: G-NiceRF(思为无线); Supplier Footprint: SMD,16x16mm; JLCPCB Part Class: Extended Part; Datasheet: https://atta.szlcsc.com/upload/public/pdf/source/20220425/530C73F5612432B98CDC262676D34B0B.pdf; Supplier: LCSC; Output Power: 20dBm; Interface Type: SPI; Modulation System: LoRa；GFSK；FSK; Voltage - Supply: 1.8V~3.7V; Receive  Current: 10.8mA; Send  Current: 120mA; Sensitivity: -139dBm
F1 = CFS12V3T2R50: Type:SMD Fuse Current Rating:2.5A Voltage Rating (DC):32V Operating Temperature:-20℃~+105℃ Operating Temperature:-20℃~+105℃ Interrupt Rating:50A; LCSC Part Name: 贴片式保险丝; Supplier Part: C163125; Manufacturer: 大毅科技; Supplier Footprint: 1206; JLCPCB Part Class: Extended Part; Datasheet: https://atta.szlcsc.com/upload/public/pdf/source/20180224/C163125_15194365416781363570.pdf; Supplier: LCSC; Type: SMD Fuse; Current Rating: 2.5A; Voltage Rating (DC): 32V; Operating Temperature: -20℃~+105℃; Interrupt Rating: 50A
L1 L2 = CY43-22UH: Inductance: Tolerance:±10% Tolerance:±10% Rated Current: Saturation Current (Isat):- DC Resistance (DCR): Q @ Freq:- Frequency - Self Resonant:- Ratings:; LCSC Part Name: 22uH ±10%; Supplier Part: C2929420; Manufacturer: SHOU HAN(首韩); Supplier Footprint: SMD,4.5x4mm; JLCPCB Part Class: Extended Part; Datasheet: https://atta.szlcsc.com/upload/public/pdf/source/20211213/476E3B4B1A8D25491C5EB2B7D1DAC42F.pdf; Supplier: LCSC; Tolerance: ±10%
Q1-Q8 Q10 = DO2301E-Q: Type:1 Piece P-Channel Drain Source Voltage (Vdss):20V Continuous Drain Current (Id):2A Drain Source On Resistance (RDS(on)@Vgs,Id):125mΩ@4.5V,2A Power Dissipation (Pd):800mW Gate Threshold Voltage (Vgs(th)@Id):400mV@250uA Total Gate Charge (Qg@Vgs):2.1nC; Supplier Part: C41384537; Manufacturer: DOINGTER(杜因特); Supplier Footprint: SOT-23; JLCPCB Part Class: Extended Part; Datasheet: https://atta.szlcsc.com/upload/public/pdf/source/20240910/DD70D4D188557A3396BF0BC76E7EAFF9.pdf; Supplier: LCSC; Type: 1 Piece P-Channel; Drain Source Voltage (Vdss): 20V; Continuous Drain Current (Id): 2A; Drain Source On Resistance (RDS(on)@Vgs,Id): 125mΩ@4.5V,2A; Power Dissipation (Pd): 800mW; Gate Threshold Voltage (Vgs(th)@Id): 400mV@250uA; Total Gate Charge (Qg@Vgs): 2.1nC@4.5V; Input Capacitance (Ciss@Vds): 150pF@10V; Reverse Transfer Capacitance (Crss@Vds): 24pF@10V; Operating Temperature: -55℃~+150℃
R3 = RTT034124FTP: Type:Thick Film Resistors Resistance: Tolerance:±1% Tolerance:±1% Power(Watts): Overload Voltage (Max): Temperature Coefficient:±100ppm/℃ Temperature Coefficient:±100ppm/℃ Operating Temperature Range:-55℃~+155℃ Operating Temperature Range:-55℃~+155℃; LCSC Part Name: 厚膜电阻 4.12MΩ ±1% 100mW; Supplier Part: C166808; Manufacturer: RALEC(旺诠); Supplier Footprint: 0603; JLCPCB Part Class: Extended Part; Datasheet: https://atta.szlcsc.com/upload/public/pdf/source/20180928/C303758_52AE496EA05AD4D633595C32F5A0EBAF.pdf; Supplier: LCSC; Type: Thick Film Resistors; Tolerance: ±1%; Temperature Coefficient: ±100ppm/℃; Operating Temperature Range: -55℃~+155℃
R4 = RTT037874FTP: Type:Thick Film Resistors Resistance: Tolerance:±1% Tolerance:±1% Power(Watts): Overload Voltage (Max): Temperature Coefficient:±100ppm/℃ Temperature Coefficient:±100ppm/℃ Operating Temperature Range:-55℃~+155℃ Operating Temperature Range:-55℃~+155℃; LCSC Part Name: 厚膜电阻 7.87MΩ ±1% 100mW; Supplier Part: C166763; Manufacturer: RALEC(旺诠); Supplier Footprint: 0603; JLCPCB Part Class: Extended Part; Datasheet: https://atta.szlcsc.com/upload/public/pdf/source/20180928/C303758_52AE496EA05AD4D633595C32F5A0EBAF.pdf; Supplier: LCSC; Type: Thick Film Resistors; Tolerance: ±1%; Temperature Coefficient: ±100ppm/℃; Operating Temperature Range: -55℃~+155℃
R5 = 0603WAF1504T5E: Type:Thick Film Resistors Resistance:1.5MΩ Tolerance:±1% Tolerance:±1% Power(Watts):0.1W Voltage-Supply(Max):75V Temperature Coefficient:±100ppm/℃ Temperature Coefficient:±100ppm/℃ Operating Temperature:-55℃~+155℃ Operating Temperature:-55℃~+155℃; LCSC Part Name: 1.5MΩ ±1% 100mW 厚膜电阻; Supplier Part: C4172; Manufacturer: UNI-ROYAL(厚声); Supplier Footprint: 0603; JLCPCB Part Class: Extended Part; Datasheet: https://atta.szlcsc.com/upload/public/pdf/source/20200306/C422600_1E6D84923E4A46A82E41ADD87F860B5C.pdf; Supplier: LCSC; Type: Thick Film Resistors; Tolerance: ±1%; Power(Watts): 0.1W; Voltage-Supply(Max): 75V; Temperature Coefficient: ±100ppm/℃; Operating Temperature: -55℃~+155℃
R6 = 0603WAF3904T5E: Type:Thick Film Resistors Resistance:3.9MΩ Tolerance:±1% Tolerance:±1% Power(Watts): Overload Voltage (Max): Temperature Coefficient:±100ppm/℃ Temperature Coefficient:±100ppm/℃ Operating Temperature Range:-55℃~+155℃ Operating Temperature Range:-55℃~+155℃; LCSC Part Name: 3.9MΩ ±1% 100mW 厚膜电阻; Supplier Part: C23019; Manufacturer: UNI-ROYAL(厚声); Supplier Footprint: 0603; JLCPCB Part Class: Extended Part; Datasheet: https://atta.szlcsc.com/upload/public/pdf/source/20200306/C422600_1E6D84923E4A46A82E41ADD87F860B5C.pdf; Supplier: LCSC; Type: Thick Film Resistors; Tolerance: ±1%; Temperature Coefficient: ±100ppm/℃; Operating Temperature Range: -55℃~+155℃
R7 R8 = RS-03L3324FT: Type:Thick Film Resistor Resistance:3.32MΩ Tolerance:±1% Tolerance:±1% Power(Watts):100mW Voltage-Supply(Max):50V Temperature Coefficient:±250ppm/℃ Temperature Coefficient:±250ppm/℃ Operating Temperature:-55℃~+155℃ Operating Temperature:-55℃~+155℃; LCSC Part Name: 厚膜电阻 3.32MΩ ±1% 100mW; Supplier Part: C322134; Manufacturer: FH(风华); Supplier Footprint: 0603; JLCPCB Part Class: Extended Part; Datasheet: https://item.szlcsc.com/datasheet/RS-03L3324FT/303039.html; Supplier: LCSC; Type: Thick Film Resistor; Tolerance: ±1%; Power(Watts): 100mW; Voltage-Supply(Max): 50V; Temperature Coefficient: ±250ppm/℃; Operating Temperature: -55℃~+155℃
SC1 SC2 = BIG_CAP_BUP002R8L107FA
U1 = BQ25505RGRR: Supplier Part: C882746; Manufacturer: TI(德州仪器); Supplier Footprint: VQFN-20-EP(3.5x3.5); JLCPCB Part Class: Extended Part; Datasheet: https://www.ti.com/cn/lit/gpn/bq25505; Supplier: LCSC
R30 = 0603WAF2201T5E_C4190: Type:Thick Film Resistors Resistance:2.2kΩ Tolerance:±1% Tolerance:±1% Power(Watts): Overload Voltage (Max): Temperature Coefficient:±100ppm/℃ Temperature Coefficient:±100ppm/℃ Operating Temperature Range:-55℃~+155℃ Operating Temperature Range:-55℃~+155℃; LCSC Part Name: 2.2kΩ ±1% 100mW 厚膜电阻; Supplier Part: C4190; Manufacturer: UNI-ROYAL(厚声); Manufacturer Part: 0603WAF2201T5E; Supplier Footprint: 0603; JLCPCB Part Class: Basic Part; Datasheet: https://atta.szlcsc.com/upload/public/pdf/source/20200306/C422600_1E6D84923E4A46A82E41ADD87F860B5C.pdf; Supplier: LCSC; Type: Thick Film Resistors; Tolerance: ±1%; Temperature Coefficient: ±100ppm/℃; Operating Temperature Range: -55℃~+155℃
R33 R34 = 0603WAF3302T5E: Type:Thick Film Resistor Resistance:33kΩ Tolerance:±1% Tolerance:±1% Power(Watts):100mW Voltage-Supply(Max):75V Temperature Coefficient:±100ppm/℃ Temperature Coefficient:±100ppm/℃ Operating Temperature:-55℃~+155℃ Operating Temperature:-55℃~+155℃; LCSC Part Name: 33kΩ ±1% 100mW 厚膜电阻; Supplier Part: C4216; Manufacturer: UNI-ROYAL(厚声); Supplier Footprint: 0603; JLCPCB Part Class: Basic Part; Datasheet: https://atta.szlcsc.com/upload/public/pdf/source/20200306/C422600_1E6D84923E4A46A82E41ADD87F860B5C.pdf; Supplier: LCSC; Type: Thick Film Resistor; Tolerance: ±1%; Power(Watts): 100mW; Voltage-Supply(Max): 75V; Temperature Coefficient: ±100ppm/℃; Operating Temperature: -55℃~+155℃
R35 R36 = 0603WAF1742T5E: Type:Thick Film Resistor Resistance:17.4kΩ Tolerance:±1% Tolerance:±1% Power(Watts):100mW Voltage-Supply(Max):75V Temperature Coefficient:±100ppm/℃ Temperature Coefficient:±100ppm/℃ Operating Temperature:-55℃~+155℃ Operating Temperature:-55℃~+155℃; LCSC Part Name: 17.4kΩ ±1% 100mW 厚膜电阻; Supplier Part: C22819; Manufacturer: UNI-ROYAL(厚声); Supplier Footprint: 0603; JLCPCB Part Class: Extended Part; Datasheet: https://atta.szlcsc.com/upload/public/pdf/source/20200306/C422600_1E6D84923E4A46A82E41ADD87F860B5C.pdf; Supplier: LCSC; Type: Thick Film Resistor; Tolerance: ±1%; Power(Watts): 100mW; Voltage-Supply(Max): 75V; Temperature Coefficient: ±100ppm/℃; Operating Temperature: -55℃~+155℃
R37 = 0603WAF3300T5E: Type:Thick Film Resistors Resistance: Tolerance:±1% Tolerance:±1% Power(Watts): Overload Voltage (Max): Temperature Coefficient:±100ppm/℃ Temperature Coefficient:±100ppm/℃ Operating Temperature Range:-55℃~+155℃ Operating Temperature Range:-55℃~+155℃; LCSC Part Name: 330Ω ±1% 100mW 厚膜电阻; Supplier Part: C23138; Manufacturer: UNI-ROYAL(厚声); Supplier Footprint: 0603; JLCPCB Part Class: Basic Part; Datasheet: https://atta.szlcsc.com/upload/public/pdf/source/20200306/C422600_1E6D84923E4A46A82E41ADD87F860B5C.pdf; Supplier: LCSC; Type: Thick Film Resistors; Tolerance: ±1%; Temperature Coefficient: ±100ppm/℃; Operating Temperature Range: -55℃~+155℃
U6 = HDC1080DMBR: Supply Voltage:2.7V~5.5V Supply Voltage:2.7V~5.5V; Supplier Part: C82227; Manufacturer: TI(德州仪器); Supplier Footprint: WSON-6(3x3); JLCPCB Part Class: Extended Part; Datasheet: https://www.ti.com/cn/lit/gpn/hdc1080; Supplier: LCSC; Supply Voltage: 2.7V~5.5V
U7 = WF183DE 15BA L8B T&R: Pressure range:0Kpa~1500Kpa Pressure range:0Kpa~1500Kpa Voltage - Supply:2.4V~5.5V Voltage - Supply:2.4V~5.5V Standby Current:2uA Operating Temperature:-40℃~+125℃ Operating Temperature:-40℃~+125℃; LCSC Part Name: 0-1500kpa,数字压力传感器,2.4V-5.5V,通信接口I²C、UART、OWI; Supplier Part: C20415992; Manufacturer: WF(伟烽); Supplier Footprint: LGA-8(3.8x3.6); JLCPCB Part Class: Extended Part; Datasheet: https://atta.szlcsc.com/upload/public/pdf/source/20240105/95D085237FE316EB17C6F10949A8B5AC.pdf; Supplier: LCSC; Pressure range: 0Kpa~1500Kpa; Voltage - Supply: 2.4V~5.5V; Standby Current: 2uA; Operating Temperature: -40℃~+125℃
U8 = GMI9745P-48DB: LCSC Part Name: 全指向φ9.7*4.5mm 1.5V-10V 灵敏度-48db 低阻抗 针脚; Supplier Part: C233964; Manufacturer: INGHAi(赢海); Supplier Footprint: 插件,D=9.7mm; JLCPCB Part Class: Extended Part; Datasheet: https://atta.szlcsc.com/upload/public/pdf/source/20200109/C233964_DF5B16EAC1FD68D13BA612A721C6E7ED.pdf; Supplier: LCSC
U9 = BA4558F-E2: Supplier Part: C79617; Manufacturer: ROHM(罗姆); Supplier Footprint: SOP-8; JLCPCB Part Class: Extended Part; Datasheet: https://atta.szlcsc.com/upload/public/pdf/source/20160729/1469779562903.pdf; Supplier: LCSC
U10 = Saiya Sensor SYP16: Air Quality Sensor; Supplier Part: C19727299
L3 L4 = LQM2HPN2R2MG0L: Inductance: Tolerance:±20% Tolerance:±20% Rated Current: Saturation Current (Isat):- DC Resistance (DCR): Q @ Freq:- Frequency - Self Resonant: Ratings:; LCSC Part Name: 2.2uH ±20%; Supplier Part: C86092; Manufacturer: muRata(村田); Supplier Footprint: 1008; JLCPCB Part Class: Extended Part; Datasheet: https://atta.szlcsc.com/upload/public/pdf/source/20180326/C86092_9C29A1E2AA95AB1022CF7FBF5DEEB894.pdf; Supplier: LCSC; Tolerance: ±20%
R11 = 0603WAF7502T5E: Type:Thick Film Resistors Resistance:75kΩ Tolerance:±1% Tolerance:±1% Power(Watts): Overload Voltage (Max): Temperature Coefficient:±100ppm/℃ Temperature Coefficient:±100ppm/℃ Operating Temperature Range:-55℃~+155℃ Operating Temperature Range:-55℃~+155℃; LCSC Part Name: 75kΩ ±1% 100mW 厚膜电阻; Supplier Part: C23242; Manufacturer: UNI-ROYAL(厚声); Supplier Footprint: 0603; JLCPCB Part Class: Basic Part; Datasheet: https://atta.szlcsc.com/upload/public/pdf/source/20200306/C422600_1E6D84923E4A46A82E41ADD87F860B5C.pdf; Supplier: LCSC; Type: Thick Film Resistors; Tolerance: ±1%; Temperature Coefficient: ±100ppm/℃; Operating Temperature Range: -55℃~+155℃
R12 = 0603WAF2324T5E: Type:Thick Film Resistors Resistance:2.32MΩ Tolerance:±1% Tolerance:±1% Power(Watts): Overload Voltage (Max): Temperature Coefficient:±100ppm/℃ Temperature Coefficient:±100ppm/℃ Operating Temperature Range:-55℃~+155℃ Operating Temperature Range:-55℃~+155℃; LCSC Part Name: 2.32MΩ ±1% 100mW 厚膜电阻; Supplier Part: C407533; Manufacturer: UNI-ROYAL(厚声); Supplier Footprint: 0603; JLCPCB Part Class: Extended Part; Datasheet: https://atta.szlcsc.com/upload/public/pdf/source/20200306/C422600_1E6D84923E4A46A82E41ADD87F860B5C.pdf; Supplier: LCSC; Type: Thick Film Resistors; Tolerance: ±1%; Temperature Coefficient: ±100ppm/℃; Operating Temperature Range: -55℃~+155℃
R14 = RTT038873FTP: Type:Thick Film Resistors Resistance: Tolerance:±1% Tolerance:±1% Power(Watts): Overload Voltage (Max): Temperature Coefficient:±100ppm/℃ Temperature Coefficient:±100ppm/℃ Operating Temperature Range:-55℃~+155℃ Operating Temperature Range:-55℃~+155℃; LCSC Part Name: 厚膜电阻 887kΩ ±1% 100mW; Supplier Part: C103858; Manufacturer: RALEC(旺诠); Supplier Footprint: 0603; JLCPCB Part Class: Extended Part; Datasheet: https://atta.szlcsc.com/upload/public/pdf/source/20191219/C158410_884373A5B7E1BC76BF57BC45A946C093.pdf; Supplier: LCSC; Type: Thick Film Resistors; Tolerance: ±1%; Temperature Coefficient: ±100ppm/℃; Operating Temperature Range: -55℃~+155℃
R15 = 0603WAF8202T5E: Type:Thick Film Resistors Resistance:82kΩ Tolerance:±1% Tolerance:±1% Power(Watts): Overload Voltage (Max): Temperature Coefficient:±100ppm/℃ Temperature Coefficient:±100ppm/℃ Operating Temperature Range:-55℃~+155℃ Operating Temperature Range:-55℃~+155℃; LCSC Part Name: 82kΩ ±1% 100mW 厚膜电阻; Supplier Part: C23254; Manufacturer: UNI-ROYAL(厚声); Supplier Footprint: 0603; JLCPCB Part Class: Basic Part; Datasheet: https://atta.szlcsc.com/upload/public/pdf/source/20200306/C422600_1E6D84923E4A46A82E41ADD87F860B5C.pdf; Supplier: LCSC; Type: Thick Film Resistors; Tolerance: ±1%; Temperature Coefficient: ±100ppm/℃; Operating Temperature Range: -55℃~+155℃
R16 = 0603WAF4533T5E: Type:Thick Film Resistors Resistance:453kΩ Tolerance:±1% Tolerance:±1% Power(Watts): Overload Voltage (Max): Temperature Coefficient:±100ppm/℃ Temperature Coefficient:±100ppm/℃ Operating Temperature Range:-55℃~+155℃ Operating Temperature Range:-55℃~+155℃; LCSC Part Name: 453kΩ ±1% 100mW 厚膜电阻; Supplier Part: C25818; Manufacturer: UNI-ROYAL(厚声); Supplier Footprint: 0603; JLCPCB Part Class: Extended Part; Datasheet: https://atta.szlcsc.com/upload/public/pdf/source/20200306/C422600_1E6D84923E4A46A82E41ADD87F860B5C.pdf; Supplier: LCSC; Type: Thick Film Resistors; Tolerance: ±1%; Temperature Coefficient: ±100ppm/℃; Operating Temperature Range: -55℃~+155℃
U2 = TLV61046ADBVR: Function:boost converterType Output Type:Adjustable Input Voltage:1.8V~5.5V Input Voltage:1.8V~5.5V Output Voltage:3.3V~28V Output Voltage:3.3V~28V Output Current (Max):- Switching Frequency:1.05MHz Operating Temperature:-40℃~+125℃@(TJ) Operating Temperat; Supplier Part: C464815; Manufacturer: TI(德州仪器); Supplier Footprint: SOT-23-6; JLCPCB Part Class: Extended Part; Datasheet: https://www.ti.com/cn/lit/gpn/tlv61046a; Supplier: LCSC; Function: boost converterType; Output Type: Adjustable; Input Voltage: 1.8V~5.5V; Output Voltage: 3.3V~28V; Switching Frequency: 1.05MHz; Operating Temperature: -40℃~+125℃@(TJ); Number of Outputs: 1; Topology: Boost; Switch tube (built-in/external): 内置
U3 U4 = TLV61070ADBVR: Function:Boost type Output Type:Adjustable Input Voltage:500mV~5.5V Input Voltage:500mV~5.5V Output Voltage:2.2V~5.5V Output Voltage:2.2V~5.5V Output Current:2.5A Switching Frequency:1MHz；550kHz Switching Frequency:1MHz；550kHz Operating Temperature:-40℃~+; LCSC Part Name: 2.5A同步升压转换器,支持0.5V超低输入电压; Supplier Part: C6881375; Manufacturer: TI(德州仪器); Supplier Footprint: SOT-23-6; JLCPCB Part Class: Extended Part; Datasheet: https://atta.szlcsc.com/upload/public/pdf/source/20230721/C6AC513B5543490C8D3B916506A0AE8A.pdf; Supplier: LCSC; Function: Boost type; Output Type: Adjustable; Input Voltage: 500mV~5.5V; Output Voltage: 2.2V~5.5V; Output Current: 2.5A; Switching Frequency: 1MHz；550kHz; Operating Temperature: -40℃~+125℃@(TJ); Synchronous Rectification: Yes; Number of Outputs: 1; Topology: Boost; Switch tube (built-in/external): Built-in
CN1 CN2 = DB125-2.54-2P-GN-S: Number of Positions or Pins:1x2P Pitch:2.54mm Color:Green Mounting Type:Through Hole Number of Pins:2P Number of Rows:1 Number of PINs Per Row:2 Current Rating:7A Voltage Rating (Max):150V Wire Gauge - AWG:18~26 Wire Gauge - AWG:18~26 Wire Gauge - mm2:1 W; LCSC Part Name: 1x2P 2.54mm 直插 排数:1 每排P数:2; Supplier Part: C918120; Manufacturer: DORABO(地博电气); Supplier Footprint: 插件,P=2.54mm; JLCPCB Part Class: Extended Part; Datasheet: https://atta.szlcsc.com/upload/public/pdf/source/20230106/BCD3A0BE1EB95DC3E813F1745F022035.pdf; Supplier: LCSC; Number of Positions or Pins: 1x2P; Pitch: 2.54mm; Color: Green; Mounting Type: Through Hole; Number of Pins: 2P; Number of Rows: 1; Number of PINs Per Row: 2; Current Rating: 7A; Voltage Rating (Max): 150V; Wire Gauge - AWG: 18~26; Wire Gauge - mm2: 1; Operating Temperature: -40℃~+105℃
CN3-CN5 = DB125-2.54-4P-GN-S: Number of Positions or Pins:1x4P Pitch:2.54mm Color:Green Mounting Type:Through Hole Number of Pins:4P Number of Rows:1 Number of PINs Per Row:4 Current Rating:7A Voltage Rating (Max):150V Wire Gauge - AWG:18~26 Wire Gauge - AWG:18~26 Wire Gauge - mm2:1 W; LCSC Part Name: 1x4P 2.54mm 直插 排数:1 每排P数:4; Supplier Part: C918122; Manufacturer: DORABO(地博电气); Supplier Footprint: 插件,P=2.54mm; JLCPCB Part Class: Extended Part; Datasheet: https://atta.szlcsc.com/upload/public/pdf/source/20230106/BCD3A0BE1EB95DC3E813F1745F022035.pdf; Supplier: LCSC; Number of Positions or Pins: 1x4P; Pitch: 2.54mm; Color: Green; Mounting Type: Through Hole; Number of Pins: 4P; Number of Rows: 1; Number of PINs Per Row: 4; Current Rating: 7A; Voltage Rating (Max): 150V; Wire Gauge - AWG: 18~26; Wire Gauge - mm2: 1; Operating Temperature: -40℃~+105℃

## Nets
3V3_SW_EN: Q7.1(G) R18.2 U11.26(D2)
5V_GEIG_EN: Q12.1(G) U11.22(D6)
5V_SENS_EN: Q9.1(G) U11.21(D7)
25V_EN: U2.4(EN) U11.25(D3)
+3V3: C22.2 C23.2 C39.1 C40.1 Q7.2(S) R16.2 R18.1 R31.2 R32.2 U4.5(VOUT) U11.2(3V3)
+3V3SW: C38.2 C41.2 C42.2 C43.2 Q7.3(D) R26.2 R30.2 U6.5(VDD) U7.3(VDD) U12.13(VCC)
+5V: C4.2 C20.2 C21.2 CN3.4 Q8.2(S) Q10.2(S) R14.2 R17.1 R19.1 U3.5(VOUT)
+5V_GEIG: C34.2 Q10.3(D) U5.5(VCC)
+5V_SENS: C35.2 C36.2 Q8.3(D) U9.8(VCC) U10.3(+5V)
+25V: C2.2 C3.2 C5.2 C6.2 C16.2 C17.2 C32.2 C33.2 CN4.4 CN5.4 L5.1 R12.2 U2.5(VOUT)
GND: C1.1 C2.1 C3.1 C5.1 C6.1 C7.1 C8.1 C9.1 C10.2 C11.1 C12.2 C13.1 C14.1 C15.1 C16.1 C17.1 C18.1 C19.1 C20.1 C21.1 C22.1 C23.1 C24.1 C25.1 C26.1 C27.1 C28.1 C29.1 C32.1 C33.1 C34.1 C35.1 C36.1 C37.1 C38.1 C39.2 C40.2 C41.1 C42.1 C43.1 CN1.2 CN2.2 CN4.1 CN4.3 CN5.1 CN5.3 CN7.1 D1.2 D6.2(A) D7.2(A) Q9.2(S) Q11.2(S) Q12.2(S) Q13.3(S) Q14.2(S) Q15.2(E) R1.1 R4.2 R8.2 R11.1 R13.1 R15.1 R20.2 R27.1 R28.2 R33.1 R34.1 SC1.2 SC2.2 U1.1(VSS) U1.5(EN#) U1.6(NC) U1.15(VSS) U1.16(NC) U1.17(NC) U1.21(EP) U2.2(GND) U3.2(GND) U4.2(GND) U5.2(GND) U6.2(GND) U6.7(EP) U7.2(GND) U8.2 U9.4(VEE) U10.4(GND) U11.14(GND) U11.27(GND) U12.1(GND) U12.8(GND) U12.10(GND)
#LOAD_EN_PRI: Q3.1(G) Q4.1(G) U1.10(VB_PRI_ON#)
#LOAD_EN_SEC: Q1.1(G) Q2.1(G) Q5.1(G) Q6.1(G) U1.9(VB_SEC_ON#)
#LORA_RES: U11.6(D19) U12.6(NRESET)
+VGG: C26.2 C27.2 D5.1(C) R23.2 R25.2
AUX_BATT+: C1.2 C12.1 CN2.1 Q4.3(D) U1.14(VBAT_PRI)
CS: U11.18(D10) U12.5(NSS)
GEIG_PULSE: D6.1(K) Q15.3(C) R26.1 U11.19(D9)
HV_DIR: CN4.2 R35.2
HV_SPD: CN5.2 R36.2
I2C_SCL: R32.1 U6.6(SCL) U7.1(SCL) U11.9(D22)
I2C_SDA: R31.1 U6.1(SDA) U7.8(SDA) U11.8(D21)
LOGIC_VCC_UNREG: C24.2 C25.2 L4.1 Q2.3(D) Q3.3(D) U4.3(EN) U4.6(VIN)
MIC_OUT: U9.1(OUT1) U9.2(-IN1) U11.7(D20)
MISO: U11.16(D12) U12.2(MISO)
MOSI: U11.17(D11) U12.3(MOSI)
MPPT_VBAT_OK: U1.13(VBAT_OK) U11.20(D8)
PANEL+: C8.2 CN1.1 L1.1 U1.2(VIN_DC)
POWER_VCC_UNREG: C13.2 C14.2 C15.2 C18.2 C19.2 L2.2 L3.1 Q6.3(D) U2.6(VIN) U3.3(EN) U3.6(VIN)
SCK: U11.1(D13) U12.4(SCK)
SERVO_CTRL: CN3.2 U11.24(D4)
SERVO_EN: Q11.1(G) R20.1 U11.23(D5)
SERVO_GND: C4.1 CN3.3 Q11.3(D)
UART_RX: D7.1(K) R37.1 U11.10(D23)
UART_TX: U10.1(UART_RX/B) U11.11(D24)
WIND_DIR: R33.2 R35.1 U11.5(D18)
WIND_SPD: R34.2 R36.1 U11.4(D17)
$2N5941: R1.2 R2.1 U1.3(VOC_SAMP)
$2N7577: L1.2 U1.20(LBOOST)
$2N8110: Q1.2(S) Q2.2(S)
$2N8222: Q3.2(S) Q4.2(S)
$2N10317: R3.1 R5.2 U1.8(VRDIV)
$2N10326: R3.2 R4.1 U1.7(VBAT_OV)
$2N10596: R5.1 R6.2 U1.11(OK_HYST)
$2N10600: R6.1 R7.1 U1.12(OK_PROG)
$2N12892: C10.1 U1.4(VREF_SAMP)
$2N21137: Q5.2(S) Q6.2(S)
$2N24422: F1.1 SC1.1 SC2.1 U1.18(VBAT_SEC)
$2N29897: R7.2 R8.1
$2N33209: C7.2 C9.2 C11.2 R2.2 R9.1 U1.19(VSTOR)
$2N33226: F1.2 Q5.3(D) R10.1
$2N34228: Q1.3(D) R9.2 R10.2
$3N6805: D4.1 Q13.2(D) R21.1
$3N8225: D1.1 D2.2
$3N8233: D2.1 D3.2
$3N8237: D3.1 D4.2
$3N8334: D5.2(A) L5.2 R21.2
$3N8590: C28.2 Q14.3(D) R22.1 U5.1(1A)
$3N8761: R23.1 R24.3
$3N8975: C29.2 Q14.1(G) R24.2
$3N11491: C30.1 Q15.1(B)
$3N12768: R24.1 R27.2
$3N22643: C31.2 CN6.1 R25.1
$3N22647: C30.2 C31.1
$3N24445: Q13.1(G) R28.1 R29.1
$3N24449: R29.2 U5.4(2Y)
$3N29810: R22.2 U5.3(2A) U5.6(1Y)
$4N2106: R30.1 U8.1 U9.3(+IN1)
$4N5820: C37.2 U7.4(VS)
$4N12930: R37.2 U10.2(UART_TX/A)
$5N3100: R11.2 R12.1 U2.3(FB)
$5N3103: L2.1 U2.1(SW)
$5N15814: L3.2 U3.1(SW)
$5N16968: L4.2 U4.1(SW)
$5N17039: R15.2 R16.1 U4.4(FB)
$5N17077: R13.2 R14.1 U3.4(FB)
$6N1191: ANT1.1 U12.9(ANT)
$7N615: Q8.1(G) Q9.3(D) R17.2
$7N629: Q10.1(G) Q12.3(D) R19.2

Not connected (* = marked no-connect by the designer): CN3 1*; U6 3(NC)* 4(NC)*; U7 5(RX)* 6(TX)* 7(OWI)*; U9 5(+IN2)* 6(-IN2)* 7(OUT2)*; U11 3(B0)* 12(VUSB)* 13(B1)* 15(VIN)* 28(#RST)* 29(D0/RX0)* 30(D1/TX0)*; U12 7(DIO5)* 11(DIO3)* 12(DIO4)* 14(DIO0)* 15(DIO1)* 16(DIO2)*

## Notes on the sheets
sheet 2
- MPPT VOC
  Selection
- Calculated
  Overvoltage
  Thresh.: 2.75V
- Calculated
  VB_OK: 1.9196V
  VB_HYST: 2.1926V
